# EasyEDA Pro project FPGA_IO_BOARD.eprj

# Schematic Schematic1
Create Date: 2023-08-28; Page Name: P1; Project Name: FPGA_IO_BOARD; Schematic Name: Schematic1; Update Date: 2023-09-22; Company: 嘉立创EDA; Page Size: A4; Version: V1.0
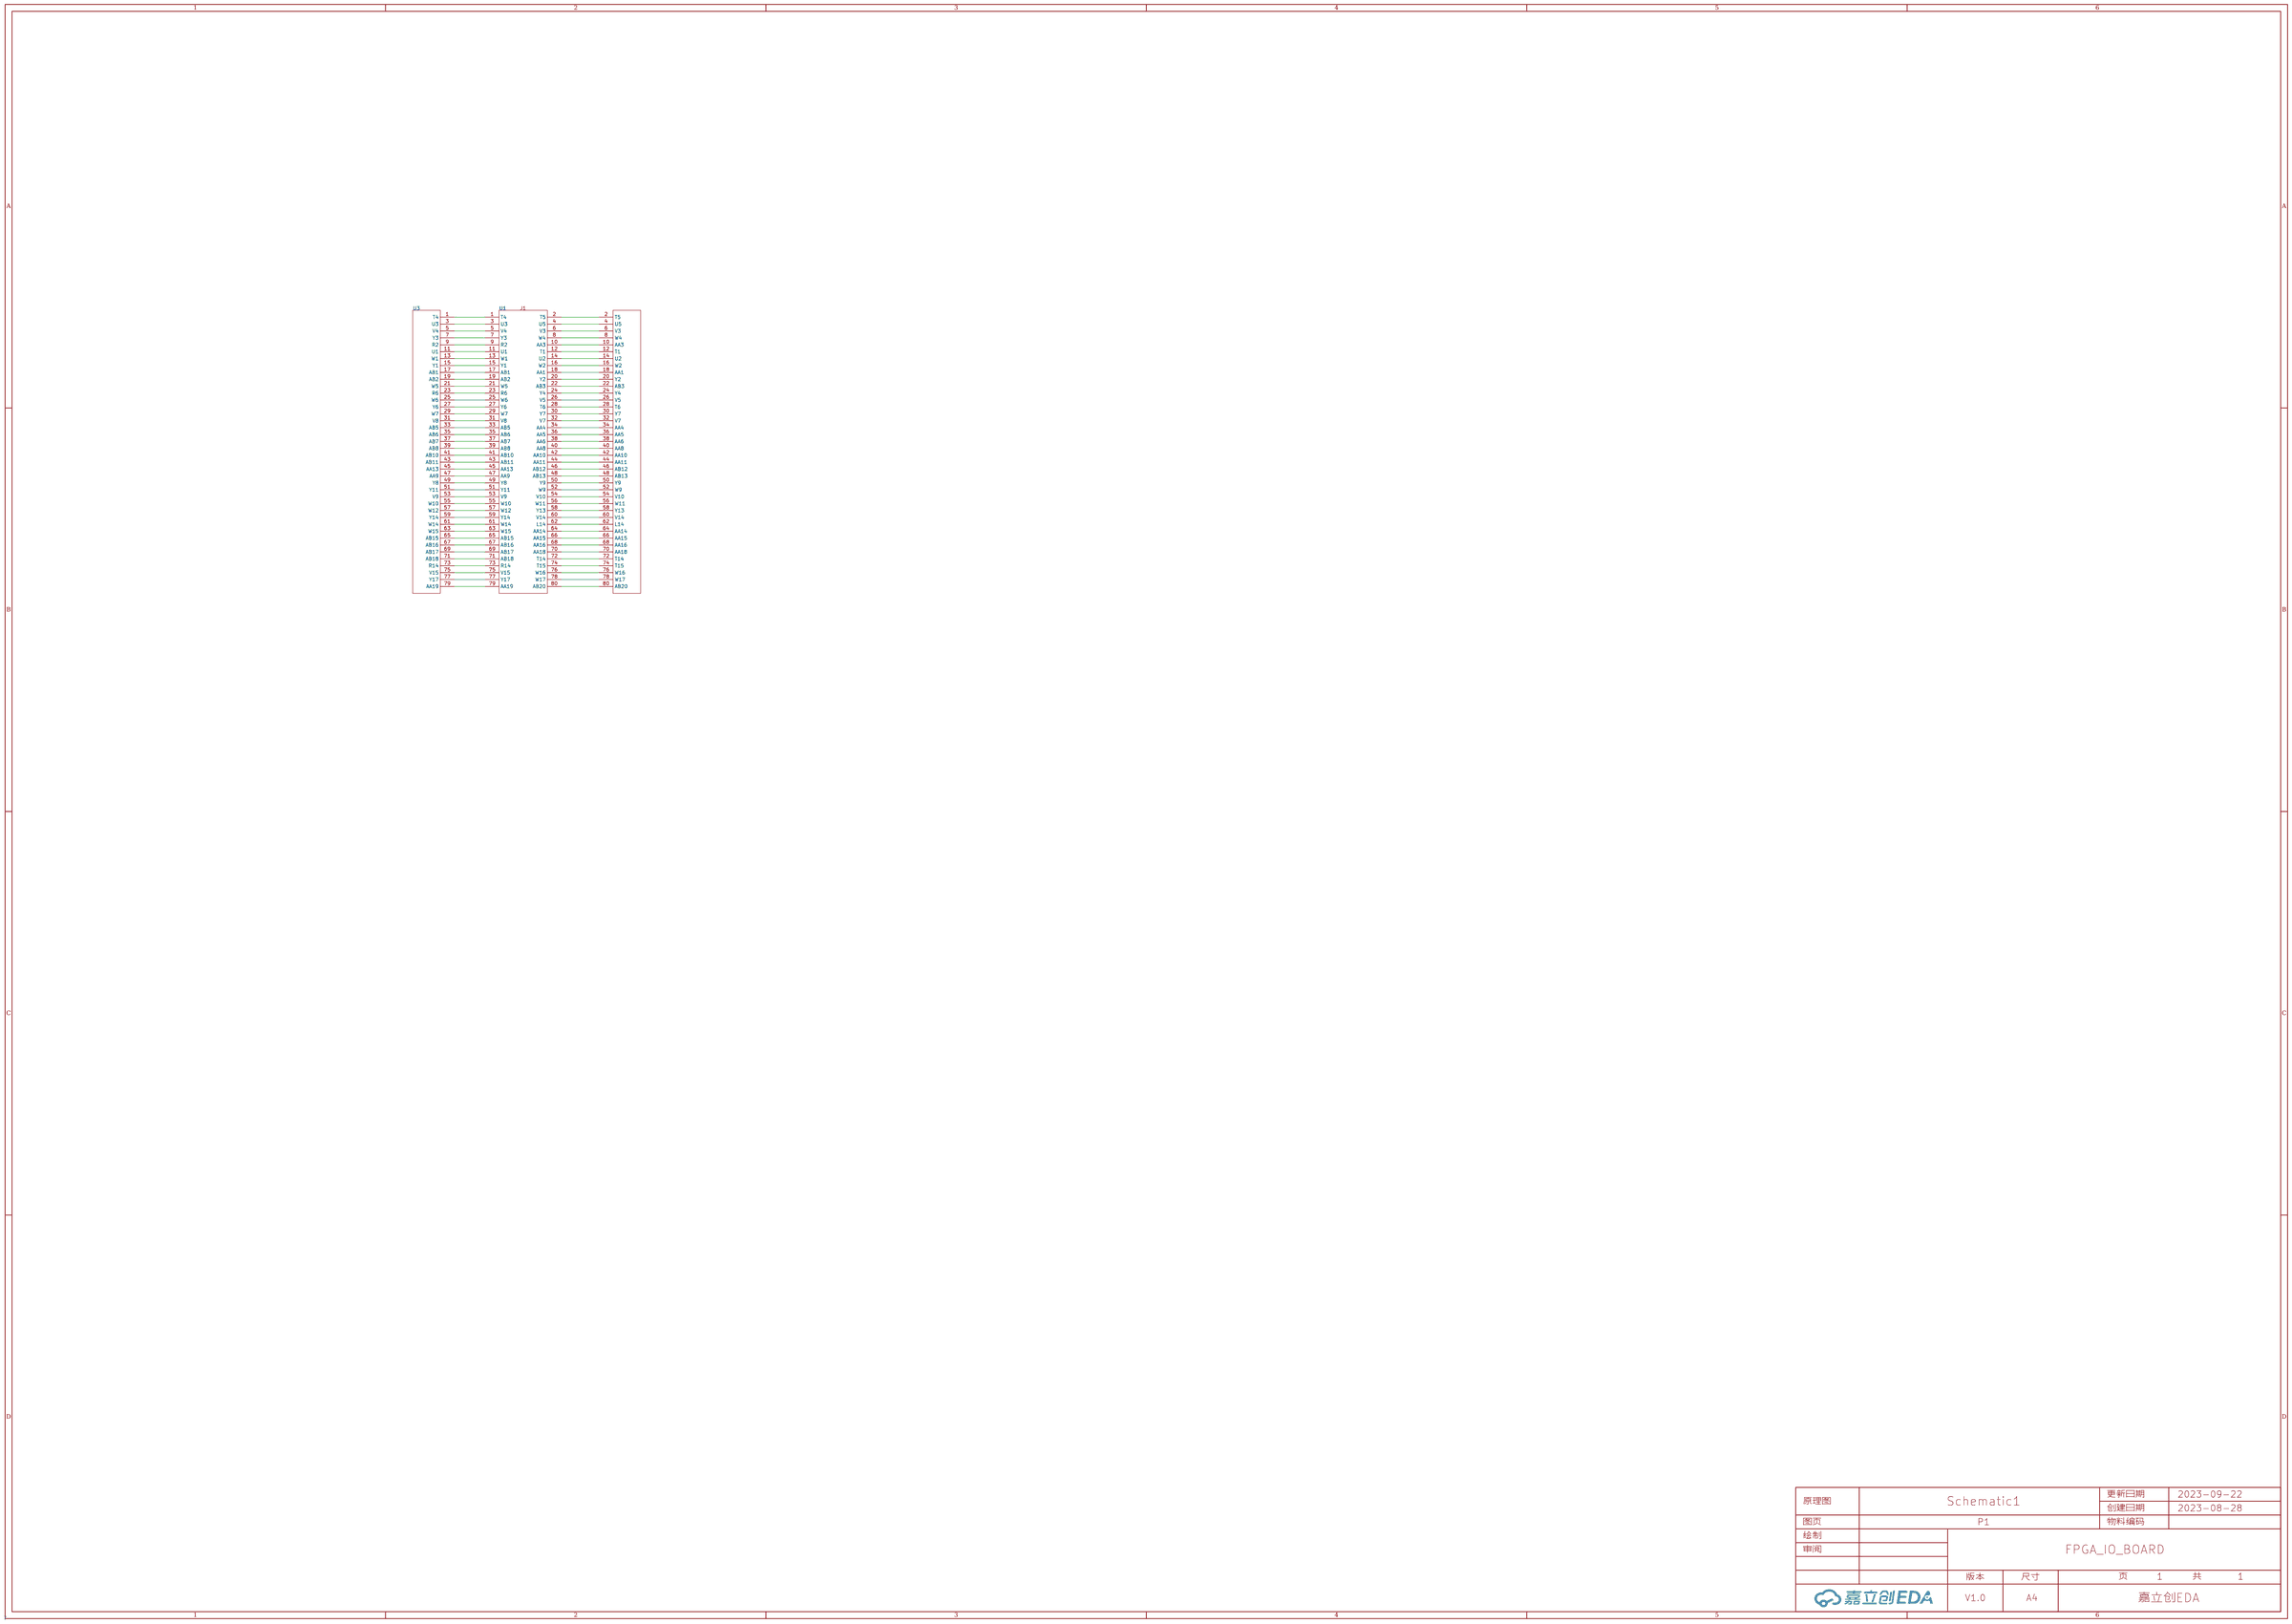
[diagram p0: schematic sheet]

## Parts
U1  -  [XC7A35T_127_PIN1_PIN80]
U3  -  [XC7A35T_254_PIN1_PIN80]

## Library data of the parts
U1 = XC7A35T_127_PIN1_PIN80: XC7A35T FPGA核心板第1脚到第80脚1.27mm底板
U3 = XC7A35T_254_PIN1_PIN80: FPGA核心板的2.54mm排针接口

## Nets
$1N7415: U1.80(AB20) U3.80(AB20)
$1N7417: U1.78(W17) U3.78(W17)
$1N7419: U1.76(W16) U3.76(W16)
$1N7421: U1.74(T15) U3.74(T15)
$1N7423: U1.72(T14) U3.72(T14)
$1N7425: U1.70(AA18) U3.70(AA18)
$1N7427: U1.68(AA16) U3.68(AA16)
$1N7429: U1.66(AA15) U3.66(AA15)
$1N7431: U1.64(AA14) U3.64(AA14)
$1N7433: U1.62(L14) U3.62(L14)
$1N7435: U1.60(V14) U3.60(V14)
$1N7437: U1.58(Y13) U3.58(Y13)
$1N7439: U1.56(W11) U3.56(W11)
$1N7441: U1.54(V10) U3.54(V10)
$1N7443: U1.52(W9) U3.52(W9)
$1N7445: U1.50(Y9) U3.50(Y9)
$1N7447: U1.48(AB13) U3.48(AB13)
$1N7449: U1.46(AB12) U3.46(AB12)
$1N7451: U1.44(AA11) U3.44(AA11)
$1N7453: U1.42(AA10) U3.42(AA10)
$1N7455: U1.40(AA8) U3.40(AA8)
$1N7457: U1.38(AA6) U3.38(AA6)
$1N7459: U1.36(AA5) U3.36(AA5)
$1N7461: U1.34(AA4) U3.34(AA4)
$1N7463: U1.32(V7) U3.32(V7)
$1N7465: U1.30(Y7) U3.30(Y7)
$1N7467: U1.28(T6) U3.28(T6)
$1N7469: U1.26(V5) U3.26(V5)
$1N7471: U1.24(Y4) U3.24(Y4)
$1N7473: U1.22(AB3) U3.22(AB3)
$1N7475: U1.20(Y2) U3.20(Y2)
$1N7477: U1.18(AA1) U3.18(AA1)
$1N7479: U1.16(W2) U3.16(W2)
$1N7481: U1.14(U2) U3.14(U2)
$1N7483: U1.12(T1) U3.12(T1)
$1N7485: U1.10(AA3) U3.10(AA3)
$1N7487: U1.8(W4) U3.8(W4)
$1N7489: U1.6(V3) U3.6(V3)
$1N7491: U1.4(U5) U3.4(U5)
$1N7493: U1.2(T5) U3.2(T5)
$1N7751: U1.1(T4) U3.1(T4)
$1N7753: U1.3(U3) U3.3(U3)
$1N7755: U1.5(V4) U3.5(V4)
$1N7757: U1.7(Y3) U3.7(Y3)
$1N7759: U1.9(R2) U3.9(R2)
$1N7761: U1.11(U1) U3.11(U1)
$1N7763: U1.13(W1) U3.13(W1)
$1N7765: U1.15(Y1) U3.15(Y1)
$1N7767: U1.17(AB1) U3.17(AB1)
$1N7769: U1.19(AB2) U3.19(AB2)
$1N7771: U1.21(W5) U3.21(W5)
$1N7773: U1.23(R6) U3.23(R6)
$1N7775: U1.25(W6) U3.25(W6)
$1N7777: U1.27(Y6) U3.27(Y6)
$1N7779: U1.29(W7) U3.29(W7)
$1N7781: U1.31(V8) U3.31(V8)
$1N7783: U1.33(AB5) U3.33(AB5)
$1N7785: U1.35(AB6) U3.35(AB6)
$1N7787: U1.37(AB7) U3.37(AB7)
$1N7789: U1.39(AB8) U3.39(AB8)
$1N7791: U1.41(AB10) U3.41(AB10)
$1N7793: U1.43(AB11) U3.43(AB11)
$1N7795: U1.45(AA13) U3.45(AA13)
$1N7797: U1.47(AA9) U3.47(AA9)
$1N7799: U1.49(Y8) U3.49(Y8)
$1N7801: U1.51(Y11) U3.51(Y11)
$1N7803: U1.53(V9) U3.53(V9)
$1N7805: U1.55(W10) U3.55(W10)
$1N7807: U1.57(W12) U3.57(W12)
$1N7809: U1.59(Y14) U3.59(Y14)
$1N7811: U1.61(W14) U3.61(W14)
$1N7813: U1.63(W15) U3.63(W15)
$1N7815: U1.65(AB15) U3.65(AB15)
$1N7817: U1.67(AB16) U3.67(AB16)
$1N7819: U1.69(AB17) U3.69(AB17)
$1N7821: U1.71(AB18) U3.71(AB18)
$1N7823: U1.73(R14) U3.73(R14)
$1N7825: U1.75(V15) U3.75(V15)
$1N7827: U1.77(Y17) U3.77(Y17)
$1N7829: U1.79(AA19) U3.79(AA19)

# Schematic Schematic2
Create Date: 2023-09-23; Page Name: P1; Project Name: FPGA_IO_BOARD; Schematic Name: Schematic2; Update Date: 2023-09-23; Company: 嘉立创EDA; Page Size: A4; Version: V1.0
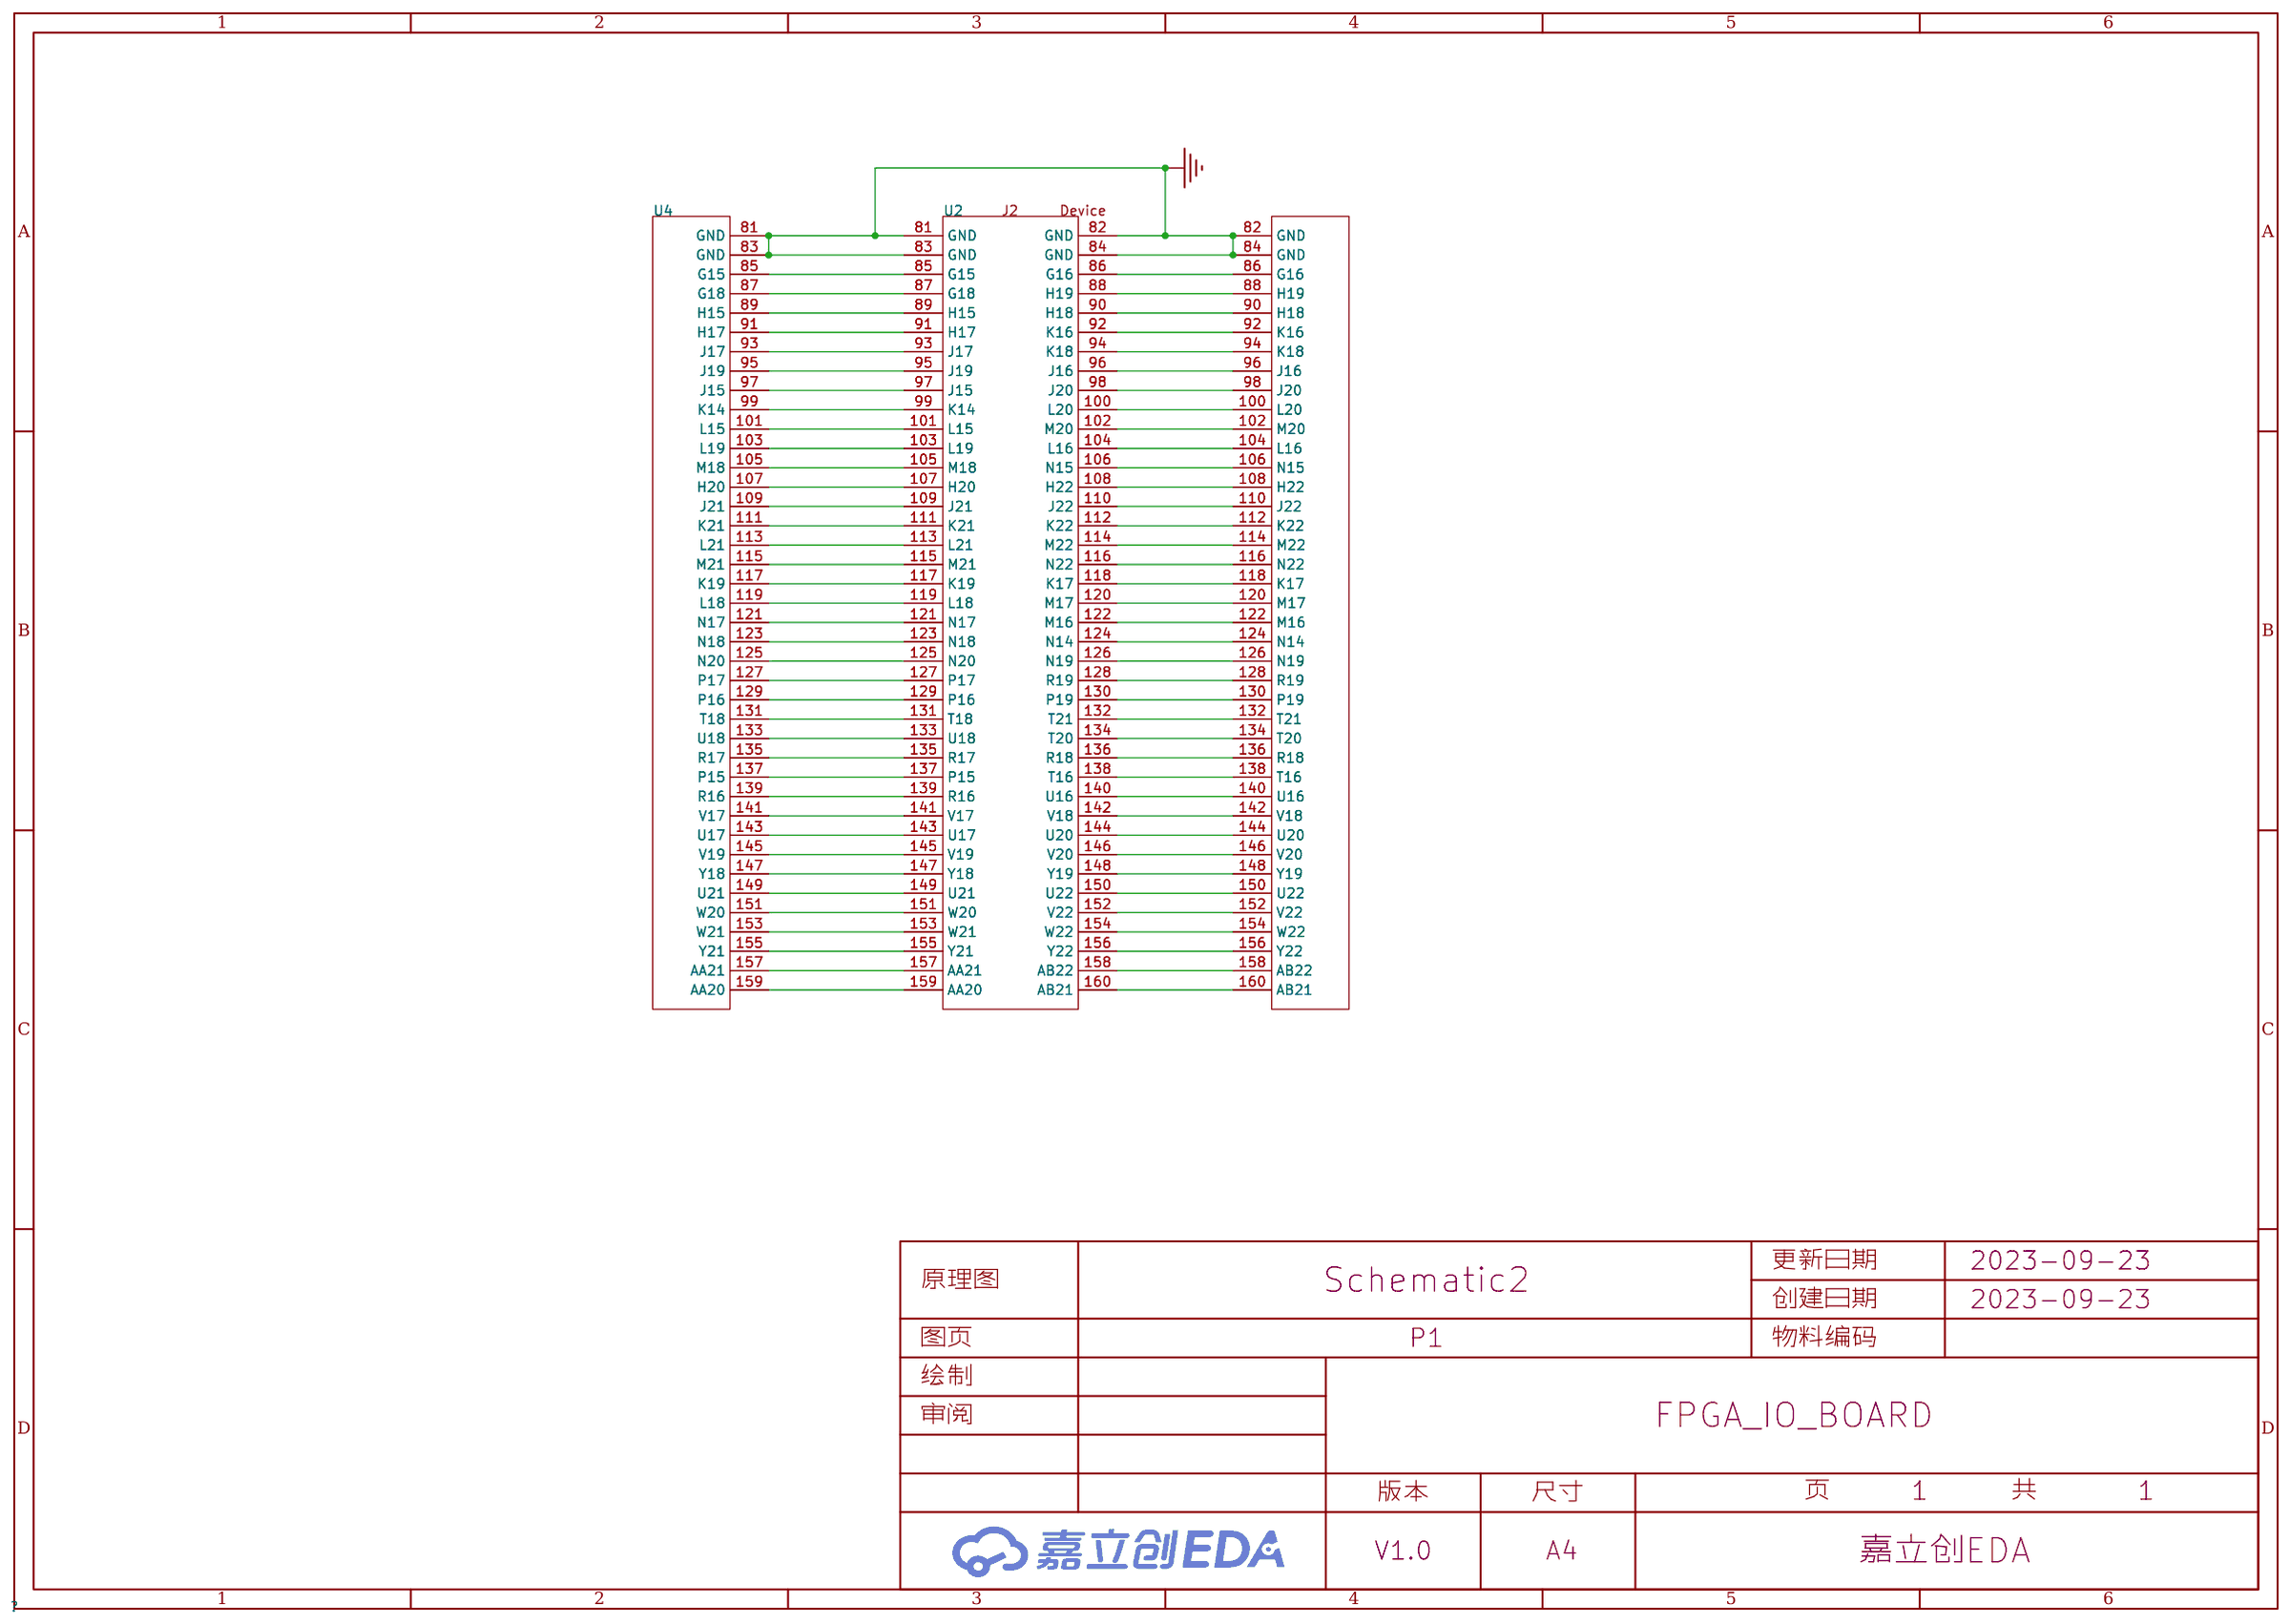
[diagram p1: schematic sheet]

## Parts
U2  -  [XC7A35T_127_PIN81_PIN160]
U4  -  [XC7A35T_254_PIN81_PIN160]

## Library data of the parts
U2 = XC7A35T_127_PIN81_PIN160: XC7A35T FPGA核心板1.27mm间距从81脚到160脚的底板扩展
U4 = XC7A35T_254_PIN81_PIN160: FPGA核心板的第81脚到第160脚扩展接口

## Nets
GND: U2.81(GND) U2.82(GND) U2.83(GND) U2.84(GND) U4.81(GND) U4.82(GND) U4.83(GND) U4.84(GND)
$1N559: U2.159(AA20) U4.159(AA20)
$1N560: U2.157(AA21) U4.157(AA21)
$1N561: U2.155(Y21) U4.155(Y21)
$1N562: U2.153(W21) U4.153(W21)
$1N563: U2.151(W20) U4.151(W20)
$1N564: U2.149(U21) U4.149(U21)
$1N565: U2.147(Y18) U4.147(Y18)
$1N566: U2.145(V19) U4.145(V19)
$1N567: U2.143(U17) U4.143(U17)
$1N568: U2.141(V17) U4.141(V17)
$1N569: U2.139(R16) U4.139(R16)
$1N570: U2.137(P15) U4.137(P15)
$1N571: U2.135(R17) U4.135(R17)
$1N572: U2.133(U18) U4.133(U18)
$1N573: U2.131(T18) U4.131(T18)
$1N574: U2.129(P16) U4.129(P16)
$1N575: U2.127(P17) U4.127(P17)
$1N576: U2.125(N20) U4.125(N20)
$1N577: U2.123(N18) U4.123(N18)
$1N578: U2.121(N17) U4.121(N17)
$1N579: U2.119(L18) U4.119(L18)
$1N580: U2.117(K19) U4.117(K19)
$1N581: U2.115(M21) U4.115(M21)
$1N582: U2.113(L21) U4.113(L21)
$1N583: U2.111(K21) U4.111(K21)
$1N584: U2.109(J21) U4.109(J21)
$1N585: U2.107(H20) U4.107(H20)
$1N586: U2.105(M18) U4.105(M18)
$1N587: U2.103(L19) U4.103(L19)
$1N588: U2.101(L15) U4.101(L15)
$1N589: U2.99(K14) U4.99(K14)
$1N590: U2.97(J15) U4.97(J15)
$1N591: U2.95(J19) U4.95(J19)
$1N592: U2.93(J17) U4.93(J17)
$1N593: U2.91(H17) U4.91(H17)
$1N594: U2.89(H15) U4.89(H15)
$1N595: U2.87(G18) U4.87(G18)
$1N596: U2.85(G15) U4.85(G15)
$1N597: U2.86(G16) U4.86(G16)
$1N598: U2.88(H19) U4.88(H19)
$1N599: U2.90(H18) U4.90(H18)
$1N600: U2.92(K16) U4.92(K16)
$1N601: U2.94(K18) U4.94(K18)
$1N602: U2.96(J16) U4.96(J16)
$1N603: U2.98(J20) U4.98(J20)
$1N604: U2.100(L20) U4.100(L20)
$1N605: U2.102(M20) U4.102(M20)
$1N606: U2.104(L16) U4.104(L16)
$1N607: U2.106(N15) U4.106(N15)
$1N608: U2.108(H22) U4.108(H22)
$1N609: U2.110(J22) U4.110(J22)
$1N610: U2.112(K22) U4.112(K22)
$1N611: U2.114(M22) U4.114(M22)
$1N612: U2.116(N22) U4.116(N22)
$1N613: U2.118(K17) U4.118(K17)
$1N614: U2.120(M17) U4.120(M17)
$1N615: U2.122(M16) U4.122(M16)
$1N616: U2.124(N14) U4.124(N14)
$1N617: U2.126(N19) U4.126(N19)
$1N618: U2.128(R19) U4.128(R19)
$1N619: U2.130(P19) U4.130(P19)
$1N620: U2.132(T21) U4.132(T21)
$1N621: U2.134(T20) U4.134(T20)
$1N622: U2.136(R18) U4.136(R18)
$1N623: U2.138(T16) U4.138(T16)
$1N624: U2.140(U16) U4.140(U16)
$1N625: U2.142(V18) U4.142(V18)
$1N626: U2.144(U20) U4.144(U20)
$1N627: U2.146(V20) U4.146(V20)
$1N628: U2.148(Y19) U4.148(Y19)
$1N629: U2.150(U22) U4.150(U22)
$1N630: U2.152(V22) U4.152(V22)
$1N631: U2.154(W22) U4.154(W22)
$1N632: U2.156(Y22) U4.156(Y22)
$1N633: U2.158(AB22) U4.158(AB22)
$1N634: U2.160(AB21) U4.160(AB21)

# Board PCB1
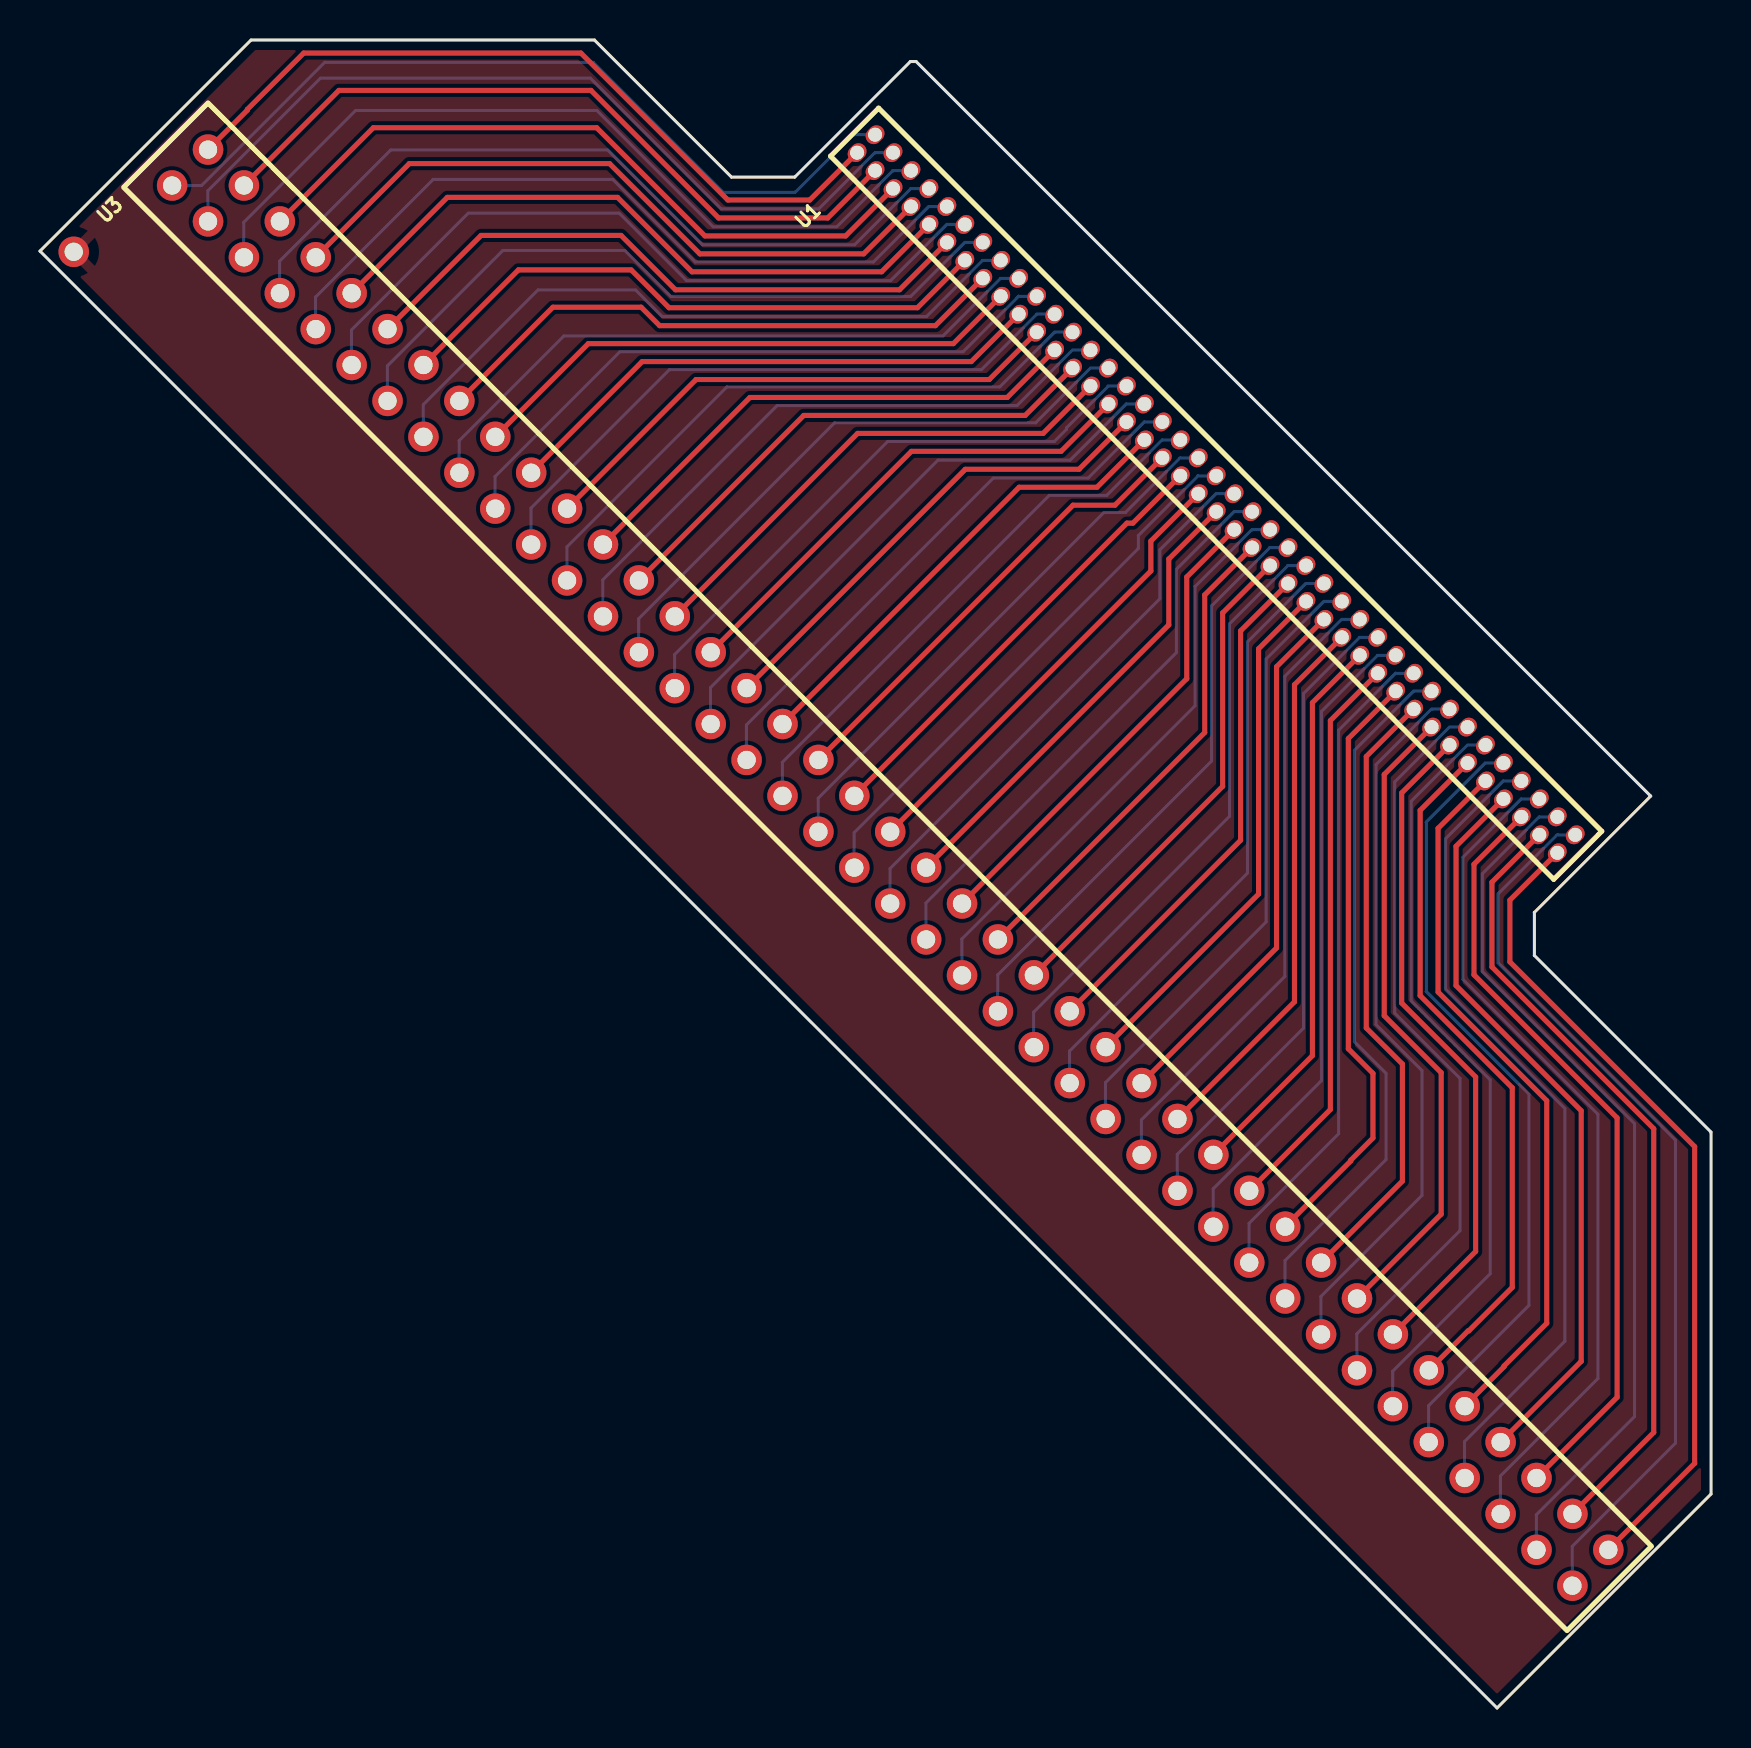
[diagram p2: board, top side]
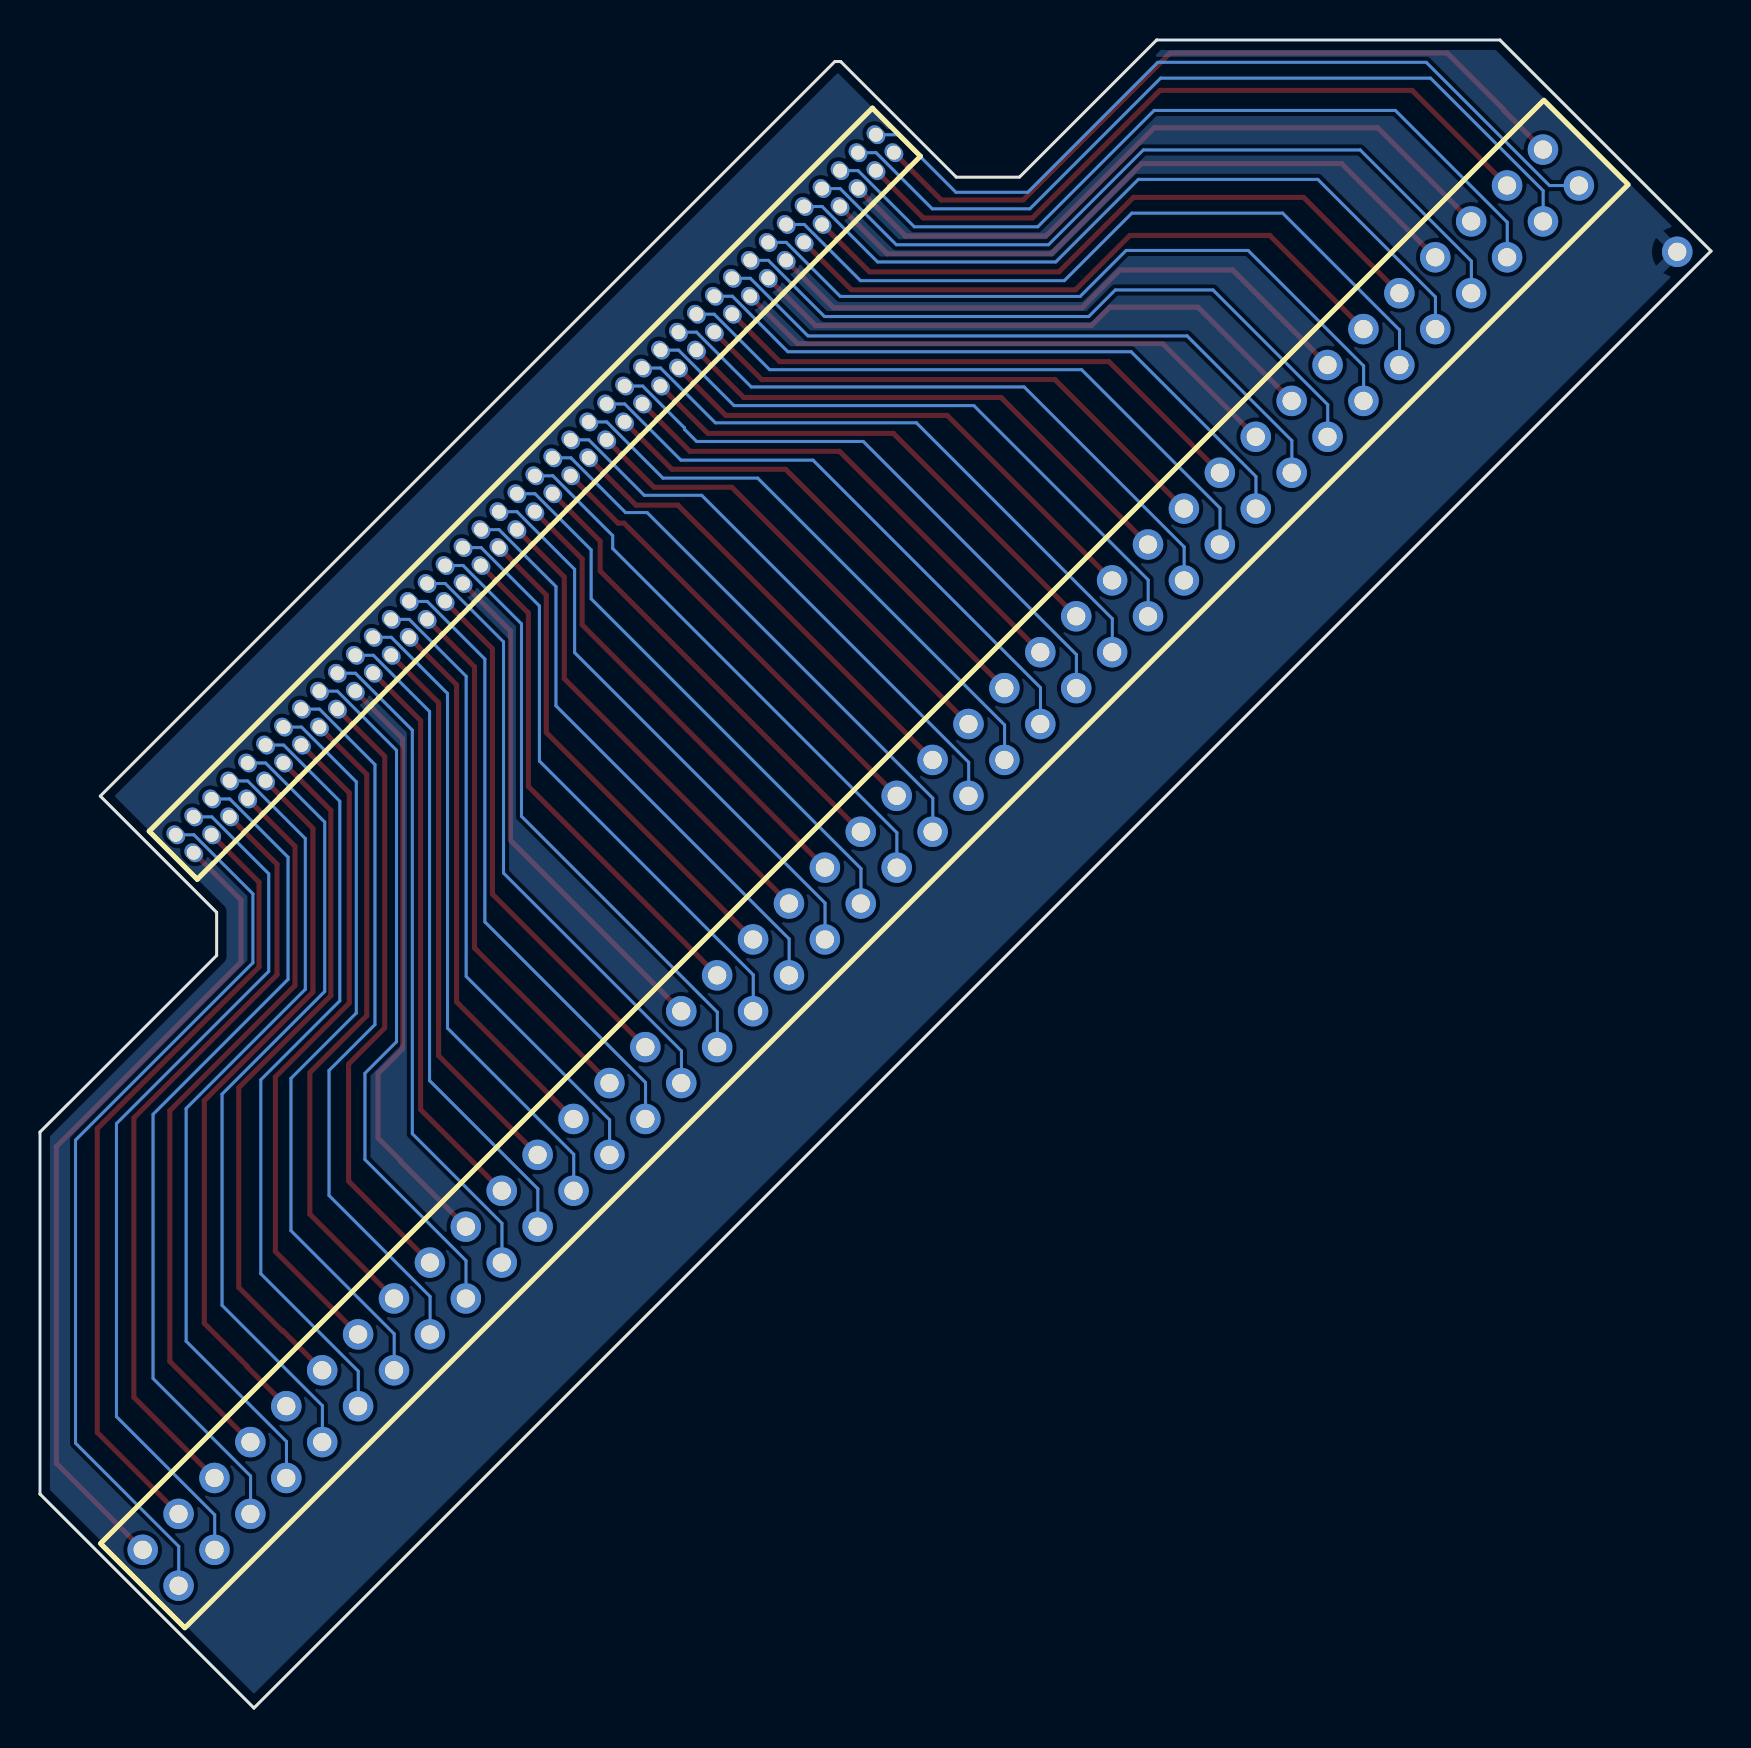
[diagram p3: board, bottom side, seen from below]

Outline 83.59 x 83.44 mm; copper layers: Top Layer, Bottom Layer. Coordinates in mm from the lower left corner of the outline.
Outline path: 0,72.88 72.88,0 83.59,10.7 83.59,28.81 74.75,37.65 74.75,39.8 80.57,45.62 43.82,82.37 43.54,82.37 37.75,76.58 34.59,76.58 27.73,83.44 10.56,83.44 0,72.88
Stack: Top Layer 0.035mm / Dielectric1 1.51mm FR4 er 4.5 / Bottom Layer 0.035mm

## Design rules (mm)
template: JLCPCB Capability(Two Layers Board)
spacing copperThickness1oz (default): track to track 0.102, other pairs 0.152 to 0.3
spacing copperThickness2oz: track to track 0.203, other pairs 0.152 to 0.3
track width copperThickness1oz (default): min 0.127, default 0.254, max 2.54
track width copperThickness2oz: min 0.203, default 0.254, max 2.54
differential pair differentialPair (default): width min 0.127, default 0.254, max 2.54; gap min 0.152, default 0.152
via viaSize (default): diameter min 0.5, default 0.61, max 10; hole min 0.3, default 0.305, max 6.3

## Placement (name value [footprint] x y rotation side)
NOREF  -  [Pad_e1113]  1.69 72.85 45 top
U1  -  [XC7A35T_127_PIN1_PIN80]  59.91 59.67 45 top
U3  -  [XC7A35T_254_PIN1_PIN80]  42.44 42.13 45 top

## Footprints (pads in the part's own frame, mm; a bottom-side part is the same pattern mirrored in y, then rotated)
Pad_e1113
  round 1.524 hole 0.914: 1(0,0)
XC7A35T_127_PIN1_PIN80
  oval 0.998x0.8 hole 0.63x0.7: 1(-0.635,26.289) 2(0.635,26.289) 3(-0.635,25.019) 4(0.635,25.019) 5(-0.635,23.749) 6(0.635,23.749) 7(-0.635,22.479) 8(0.635,22.479) 9(-0.635,21.209) 10(0.635,21.209) 11(-0.635,19.939) 12(0.635,19.939) 13(-0.635,18.669) 14(0.635,18.669) 15(-0.635,17.399) 16(0.635,17.399) 17(-0.635,16.129) 18(0.635,16.129) 19(-0.635,14.859) 20(0.635,14.859) 21(-0.635,13.589) 22(0.635,13.589) 23(-0.635,12.319) 24(0.635,12.319) 25(-0.635,11.049) 26(0.635,11.049) 27(-0.635,9.779) 28(0.635,9.779) 29(-0.635,8.509) 30(0.635,8.509) 31(-0.635,7.239) 32(0.635,7.239) 33(-0.635,5.969) 34(0.635,5.969) 35(-0.635,4.699) 36(0.635,4.699) 37(-0.635,3.429) 38(0.635,3.429) 39(-0.635,2.159) 40(0.635,2.159) 41(-0.635,0.889) 42(0.635,0.889) 43(-0.635,-0.381) 44(0.635,-0.381) 45(-0.635,-1.651) 46(0.635,-1.651) 47(-0.635,-2.921) 48(0.635,-2.921) 49(-0.635,-4.191) 50(0.635,-4.191) 51(-0.635,-5.461) 52(0.635,-5.461) 53(-0.635,-6.731) 54(0.635,-6.731) 55(-0.635,-8.001) 56(0.635,-8.001) 57(-0.635,-9.271) 58(0.635,-9.271) 59(-0.635,-10.541) 60(0.635,-10.541) 61(-0.635,-11.811) 62(0.635,-11.811) 63(-0.635,-13.081) 64(0.635,-13.081) 65(-0.635,-14.351) 66(0.635,-14.351) 67(-0.635,-15.621) 68(0.635,-15.621) 69(-0.635,-16.891) 70(0.635,-16.891) 71(-0.635,-18.161) 72(0.635,-18.161) 73(-0.635,-19.431) 74(0.635,-19.431) 75(-0.635,-20.701) 76(0.635,-20.701) 77(-0.635,-21.971) 78(0.635,-21.971) 79(-0.635,-23.241) 80(0.635,-23.241)
XC7A35T_254_PIN1_PIN80
  round 1.524 hole 0.914: 1(1.27,49.403) 2(-1.27,49.403) 3(1.27,46.863) 4(-1.27,46.863) 5(1.27,44.323) 6(-1.27,44.323) 7(1.27,41.783) 8(-1.27,41.783) 9(1.27,39.243) 10(-1.27,39.243) 11(1.27,36.703) 12(-1.27,36.703) 13(1.27,34.163) 14(-1.27,34.163) 15(1.27,31.623) 16(-1.27,31.623) 17(1.27,29.083) 18(-1.27,29.083) 19(1.27,26.543) 20(-1.27,26.543) 21(1.27,24.003) 22(-1.27,24.003) 23(1.27,21.463) 24(-1.27,21.463) 25(1.27,18.923) 26(-1.27,18.923) 27(1.27,16.383) 28(-1.27,16.383) 29(1.27,13.843) 30(-1.27,13.843) 31(1.27,11.303) 32(-1.27,11.303) 33(1.27,8.763) 34(-1.27,8.763) 35(1.27,6.223) 36(-1.27,6.223) 37(1.27,3.683) 38(-1.27,3.683) 39(1.27,1.143) 40(-1.27,1.143) 41(1.27,-1.397) 42(-1.27,-1.397) 43(1.27,-3.937) 44(-1.27,-3.937) 45(1.27,-6.477) 46(-1.27,-6.477) 47(1.27,-9.017) 48(-1.27,-9.017) 49(1.27,-11.557) 50(-1.27,-11.557) 51(1.27,-14.097) 52(-1.27,-14.097) 53(1.27,-16.637) 54(-1.27,-16.637) 55(1.27,-19.177) 56(-1.27,-19.177) 57(1.27,-21.717) 58(-1.27,-21.717) 59(1.27,-24.257) 60(-1.27,-24.257) 61(1.27,-26.797) 62(-1.27,-26.797) 63(1.27,-29.337) 64(-1.27,-29.337) 65(1.27,-31.877) 66(-1.27,-31.877) 67(1.27,-34.417) 68(-1.27,-34.417) 69(1.27,-36.957) 70(-1.27,-36.957) 71(1.27,-39.497) 72(-1.27,-39.497) 73(1.27,-42.037) 74(-1.27,-42.037) 75(1.27,-44.577) 76(-1.27,-44.577) 77(1.27,-47.117) 78(-1.27,-47.117) 79(1.27,-49.657) 80(-1.27,-49.657)

## Nets
As in the schematic.

## Routing (per net, layer and track width the routed paths; a pad name or vN(x,y) marks a point on that pad's centre or on a via; arc(x,y) is an arc through that point)
$1N7415: length 45.5
  Bottom Layer w0.152: U1.80 75.89,43.68 72.94,40.73 72.94,37.28 81.81,28.41 81.81,13.25 76.65,8.09 76.65,6.12
$1N7417: length 43.9
  Bottom Layer w0.152: 74.85,7.91 74.85,9.67 79.76,14.58 79.76,29.23 72.15,36.85 72.15,41.73 74.99,44.58 U1.78
$1N7419: length 42.7
  Bottom Layer w0.152: U1.76 74.1,45.48 71.18,42.56 71.18,36.45 77.93,29.7 77.93,16.48 73.05,11.61 73.05,9.71
$1N7421: length 41.5
  Bottom Layer w0.152: 71.26,11.51 71.26,13.33 76.28,18.35 76.28,29.99 70.32,35.95 70.32,43.5 73.2,46.38 U1.74
$1N7423: length 40.3
  Bottom Layer w0.152: U1.72 72.3,47.28 69.35,44.32 69.35,35.84 74.48,30.71 74.48,20.15 69.46,15.13 69.46,13.3
$1N7425: length 38.8
  Bottom Layer w0.152: U1.70 71.4,48.17 68.59,45.36 68.59,35.38 72.54,31.43 72.54,21.73 67.67,16.85 67.67,15.1
$1N7427: length 37.7
  Bottom Layer w0.152: U1.68 70.5,49.07 67.77,46.33 67.77,34.77 71.03,31.5 71.03,23.88 65.87,18.72 65.87,16.89
$1N7429: length 36.4
  Bottom Layer w0.152: U1.66 69.61,49.97 66.83,47.19 66.83,34.19 69.13,31.89 69.13,25.64 64.07,20.59 64.07,18.69
$1N7431: length 35.3
  Bottom Layer w0.152: U1.64 68.71,50.87 65.75,47.91 65.75,33.33 67.33,31.75 67.33,27.44 62.28,22.38 62.28,20.49
$1N7433: length 33.4
  Bottom Layer w0.152: U1.62 67.81,51.77 64.96,48.92 64.96,28.73 60.48,24.25 60.48,22.28
$1N7435: length 32.9
  Bottom Layer w0.152: U1.60 66.91,52.66 64.1,49.85 64.1,31.39 58.69,25.97 58.69,24.08
$1N7437: length 32.4
  Bottom Layer w0.152: U1.58 66.01,53.56 63.2,50.75 63.2,34.01 56.89,27.7 56.89,25.87
$1N7439: length 31.8
  Bottom Layer w0.152: U1.56 65.12,54.46 62.27,51.61 62.27,36.6 55.09,29.42 55.09,27.67
$1N7441: length 31.3
  Bottom Layer w0.152: U1.54 64.22,55.36 61.34,52.48 61.34,39.33 53.3,31.29 53.3,29.47
$1N7443: length 30.8
  Bottom Layer w0.152: 51.5,31.26 51.5,32.87 60.4,41.77 60.4,53.34 63.32,56.26 U1.52
$1N7445: length 30.3
  Bottom Layer w0.152: U1.50 62.42,57.15 59.5,54.23 59.5,44.61 49.71,34.81 49.71,33.06
$1N7447: length 29.7
  Bottom Layer w0.152: 47.91,34.85 47.91,36.68 58.61,47.37 58.61,55.13 61.52,58.05 U1.48
$1N7449: length 29.2
  Bottom Layer w0.152: U1.46 60.63,58.95 57.78,56.1 57.78,50.14 46.11,38.47 46.11,36.65
$1N7451: length 28.7
  Bottom Layer w0.152: 44.32,38.45 44.32,40.27 56.85,52.8 56.85,56.97 59.73,59.85 U1.44
$1N7453: length 28.2
  Bottom Layer w0.152: U1.42 58.83,60.75 56.02,57.94 56.02,55.49 42.52,41.99 42.52,40.24
$1N7455: length 27.6
  Bottom Layer w0.152: 58.83,61.64 57.93,61.64 54.94,58.65 54.94,58.01 40.72,43.79 40.72,42.04
$1N7457: length 27.7
  Bottom Layer w0.152: 38.93,43.83 38.93,45.52 53.22,59.8 54.3,59.8 57.03,62.54 U1.38
$1N7459: length 28.3
  Bottom Layer w0.152: 37.13,45.63 37.13,47.31 50.49,60.67 53.36,60.67 56.14,63.44 57.04,63.44
$1N7461: length 28.8
  Bottom Layer w0.152: U1.34 55.24,64.34 52.43,61.53 47.69,61.53 35.34,49.18 35.34,47.43
$1N7463: length 29.4
  Bottom Layer w0.152: 55.24,65.24 54.34,65.24 51.53,62.43 44.92,62.43 33.54,51.05 33.54,49.22
$1N7465: length 29.9
  Bottom Layer w0.152: 31.75,51.02 31.75,52.7 42.41,63.36 50.74,63.36 51.35,63.97 51.35,64.04 53.44,66.13 U1.30
$1N7467: length 30.4
  Bottom Layer w0.152: 53.45,67.03 52.54,67.03 49.81,64.29 39.75,64.29 29.95,54.5 29.95,52.81
$1N7469: length 31
  Bottom Layer w0.152: 28.15,54.61 28.15,56.44 36.87,65.16 48.87,65.16 51.65,67.93 U1.26
$1N7471: length 31.4
  Bottom Layer w0.152: 26.36,56.41 26.36,58.09 34.36,66.09 48.01,66.09 50.75,68.83 51.65,68.83
$1N7473: length 32
  Bottom Layer w0.152: U1.22 49.86,69.73 47.09,66.95 31.49,66.95 24.56,60.03 24.56,58.2
$1N7475: length 32.4
  Bottom Layer w0.152: 22.76,60 22.76,61.61 29.01,67.85 46.18,67.85 48.95,70.62 49.85,70.62
$1N7477: length 33
  Bottom Layer w0.152: U1.18 48.05,71.52 45.17,68.64 26.2,68.64 20.97,63.4 20.97,61.8
$1N7479: length 34.6
  Bottom Layer w0.152: 19.17,63.59 19.17,65.2 24.91,70.94 29.8,70.94 31.13,69.61 44.34,69.61 47.16,72.42 48.06,72.42
$1N7481: length 36
  Bottom Layer w0.152: 17.38,65.39 17.38,67.14 23.15,72.91 29.26,72.91 31.56,70.62 43.55,70.62 46.26,73.32 U1.14
$1N7483: length 37.4
  Bottom Layer w0.152: 15.58,67.18 15.58,68.94 21.43,74.78 28.97,74.78 32.35,71.41 42.55,71.41 45.36,74.22 46.26,74.22
$1N7485: length 38.5
  Bottom Layer w0.152: 13.78,68.98 13.78,70.59 19.67,76.47 28.65,76.47 32.78,72.34 41.69,72.34 44.46,75.11 45.36,75.11
$1N7487: length 39.5
  Bottom Layer w0.152: 11.99,70.78 11.99,72.38 17.55,77.94 28.4,77.94 33.14,73.2 40.75,73.2 43.56,76.01 U1.8
$1N7489: length 41
  Bottom Layer w0.152: 43.57,76.91 42.67,76.91 39.85,74.1 33.68,74.1 27.86,79.92 15.79,79.92 10.19,74.32 10.19,72.57
$1N7491: length 42
  Bottom Layer w0.152: U1.4 41.77,77.81 38.96,75 34.07,75 27.53,81.54 14.03,81.54 8.4,75.9 8.4,74.37
$1N7493: length 41.6
  Bottom Layer w0.152: 6.6,76.16 8.08,76.16 14.24,82.33 27.68,82.33 34.18,75.82 37.77,75.82 40.65,78.71 U1.2
$1N7751: length 38.5
  Top Layer w0.254: U1.1 38.5,75.44 34.41,75.44 27.06,82.79 13.19,82.79 10.37,79.97 10.37,79.94 8.4,77.96
$1N7753: length 37.2
  Top Layer w0.254: 10.19,76.16 14.95,80.92 27.56,80.92 33.94,74.54 39.4,74.54 U1.3
$1N7755: length 35.8
  Top Layer w0.254: 11.99,74.37 16.68,79.06 27.85,79.06 33.26,73.64 40.3,73.64 U1.5
$1N7757: length 34.6
  Top Layer w0.254: 13.78,72.57 18.47,77.26 28.49,77.26 33.01,72.74 41.2,72.74 43.57,75.11
$1N7759: length 33.4
  Top Layer w0.254: U1.9 42.1,71.85 32.61,71.85 28.89,75.57 20.38,75.57 15.58,70.78
$1N7761: length 32
  Top Layer w0.254: 17.38,68.98 22.06,73.67 29.07,73.67 31.79,70.95 43,70.95 45.36,73.32
$1N7763: length 30.8
  Top Layer w0.254: 19.17,67.18 23.93,71.94 29.57,71.94 31.46,70.05 43.89,70.05 46.26,72.42
$1N7765: length 29.5
  Top Layer w0.254: U1.15 44.79,69.15 31,69.15 30.07,70.08 25.66,70.08 20.97,65.39
$1N7767: length 28.2
  Top Layer w0.254: 48.06,70.62 45.69,68.25 27.43,68.25 22.76,63.59
$1N7769: length 27.7
  Top Layer w0.254: 24.56,61.8 30.12,67.36 46.59,67.36 U1.19
$1N7771: length 27.2
  Top Layer w0.254: 26.36,60 32.82,66.46 47.49,66.46 49.85,68.83
$1N7773: length 26.6
  Top Layer w0.254: U1.23 48.38,65.56 35.51,65.56 28.15,58.2
$1N7775: length 26.1
  Top Layer w0.254: 29.95,56.41 38.2,64.66 49.28,64.66 51.65,67.03
$1N7777: length 25.6
  Top Layer w0.254: U1.27 50.18,63.76 40.9,63.76 31.75,54.61
$1N7779: length 25.1
  Top Layer w0.254: 33.54,52.81 43.59,62.87 51.08,62.87 53.45,65.24
$1N7781: length 24.5
  Top Layer w0.254: 35.34,51.02 46.29,61.97 51.98,61.97 U1.31
$1N7783: length 24
  Top Layer w0.254: 55.24,63.44 52.87,61.07 48.98,61.07 37.13,49.22
$1N7785: length 23.5
  Top Layer w0.254: 38.93,47.43 51.67,60.17 53.77,60.17 U1.35
$1N7787: length 22.9
  Top Layer w0.254: 40.72,45.63 54.37,59.27 54.67,59.27 57.04,61.64
$1N7789: length 23.3
  Top Layer w0.254: 42.52,43.83 55.57,56.88 55.57,58.38 U1.39
$1N7791: length 23.8
  Top Layer w0.254: 44.32,42.04 56.47,54.19 56.47,57.48 58.83,59.85
$1N7793: length 24.3
  Top Layer w0.254: 46.11,40.24 57.36,51.49 57.36,56.58 U1.43
$1N7795: length 24.9
  Top Layer w0.254: 47.91,38.45 58.26,48.8 58.26,55.68 U1.45
$1N7797: length 25.4
  Top Layer w0.254: 49.71,36.65 59.16,46.1 59.16,54.78 U1.47
$1N7799: length 25.9
  Top Layer w0.254: U1.49 60.06,53.89 60.06,43.41 51.5,34.85
$1N7801: length 26.5
  Top Layer w0.254: U1.51 60.96,52.99 60.96,40.72 53.3,33.06
$1N7803: length 27
  Top Layer w0.254: 55.09,31.26 61.85,38.02 61.85,52.09 U1.53
$1N7805: length 27.5
  Top Layer w0.254: U1.55 62.75,51.19 62.75,35.33 56.89,29.47
$1N7807: length 28
  Top Layer w0.254: U1.57 63.65,50.29 63.65,32.63 58.69,27.67
$1N7809: length 28.6
  Top Layer w0.254: 60.48,25.87 64.55,29.94 64.55,49.4 U1.59
$1N7811: length 30.1
  Top Layer w0.254: 62.28,24.08 65.56,27.37 65.56,27.4 66.68,28.51 66.68,31.75 65.45,32.98 65.45,48.5 U1.61
$1N7813: length 31.1
  Top Layer w0.254: 64.07,22.28 68.15,26.36 68.15,32.21 66.34,34.02 66.34,47.6 U1.63
$1N7815: length 32.5
  Top Layer w0.254: 65.87,20.49 70.09,24.71 70.09,31.78 67.24,34.63 67.24,46.7 U1.65
$1N7817: length 33.7
  Top Layer w0.254: 67.67,18.69 71.81,22.84 71.81,31.57 68.12,35.27 68.12,45.78 U1.67
$1N7819: length 35
  Top Layer w0.254: U1.69 69.04,44.91 69.04,35.64 73.65,31.03 73.65,21.04 71.47,18.87 71.44,18.87 69.46,16.89
$1N7821: length 36.2
  Top Layer w0.254: U1.71 69.94,44.01 69.94,35.82 75.37,30.38 75.37,19.25 73.23,17.11 73.23,17.07 71.26,15.1
$1N7823: length 37.4
  Top Layer w0.254: U1.73 70.83,43.11 70.83,36.14 77.1,29.88 77.1,17.34 73.05,13.3
$1N7825: length 38.7
  Top Layer w0.254: U1.75 71.73,42.21 71.73,36.68 78.89,29.52 78.89,15.55 74.85,11.51
$1N7827: length 40
  Top Layer w0.254: U1.77 72.63,41.31 72.63,37.07 80.72,28.98 80.72,13.79 76.65,9.71
$1N7829: length 41.5
  Top Layer w0.254: 78.44,7.91 82.77,12.24 82.77,28.08 73.53,37.33 73.53,40.42 U1.79

## Copper pours and planes (outline as drawn; the poured copper is in the pictures)
GND on Top Layer: 83.59,10.7 83.59,28.81 74.75,37.65 74.75,39.8 80.57,45.62 43.82,82.37 43.54,82.37 37.75,76.58 34.59,76.58 27.73,83.44 10.56,83.44 0,72.88 72.88,0
GND on Bottom Layer: 83.59,10.7 83.59,28.81 74.75,37.65 74.75,39.8 80.57,45.62 43.82,82.37 43.54,82.37 37.75,76.58 34.59,76.58 27.73,83.44 10.56,83.44 0,72.88 72.88,0

# Board PCB5
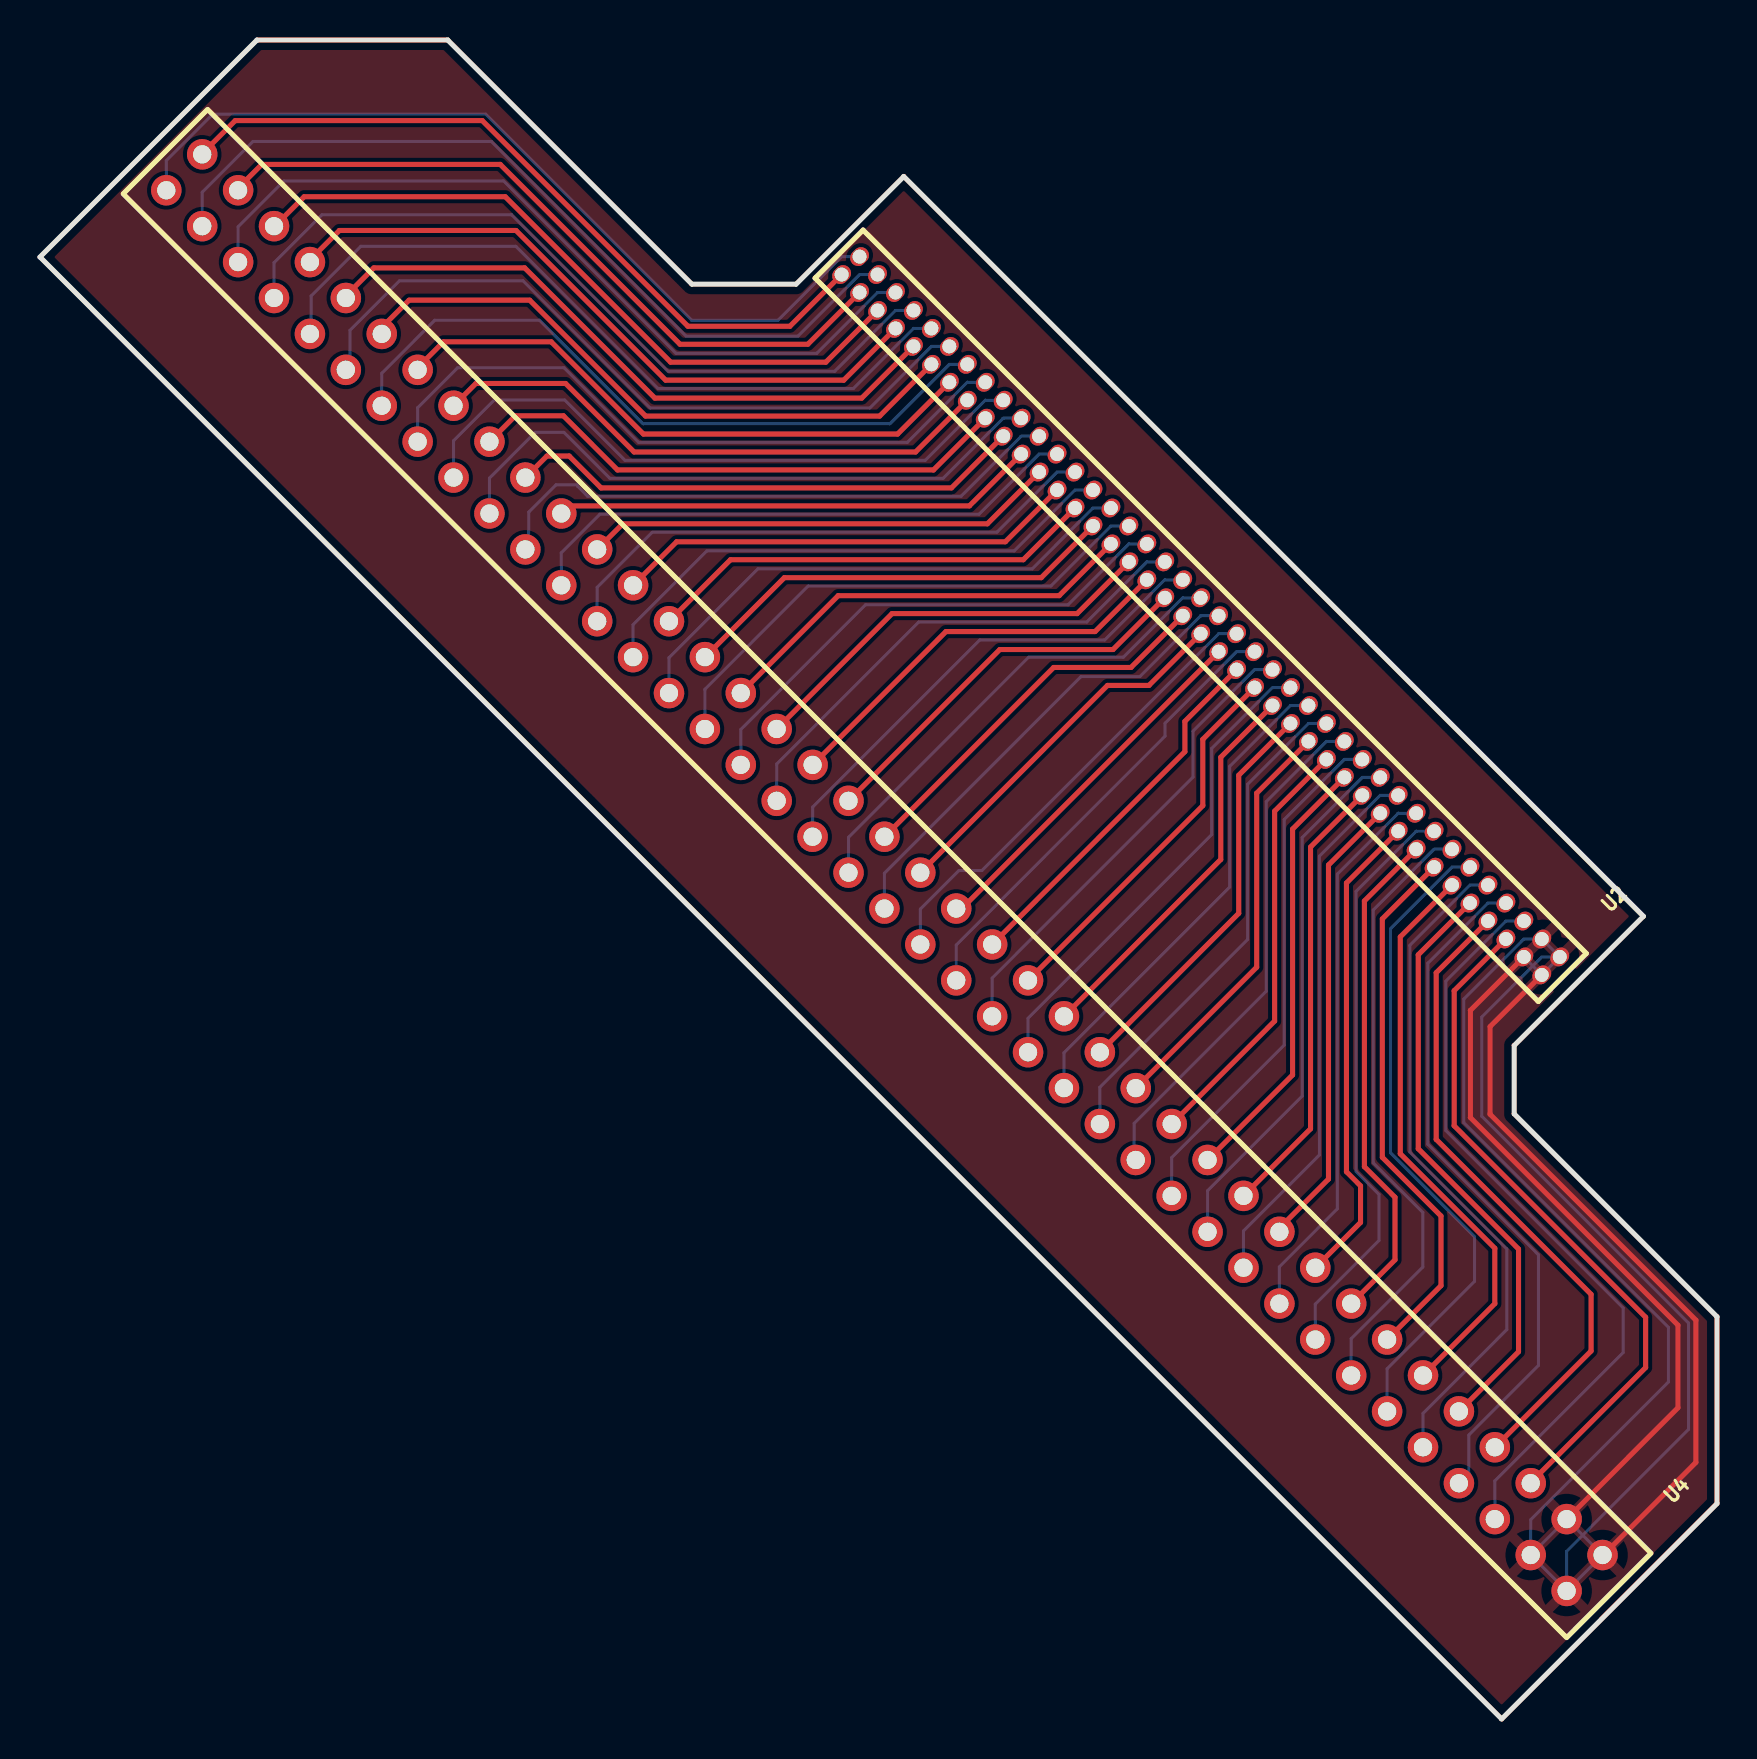
[diagram p4: board, top side]
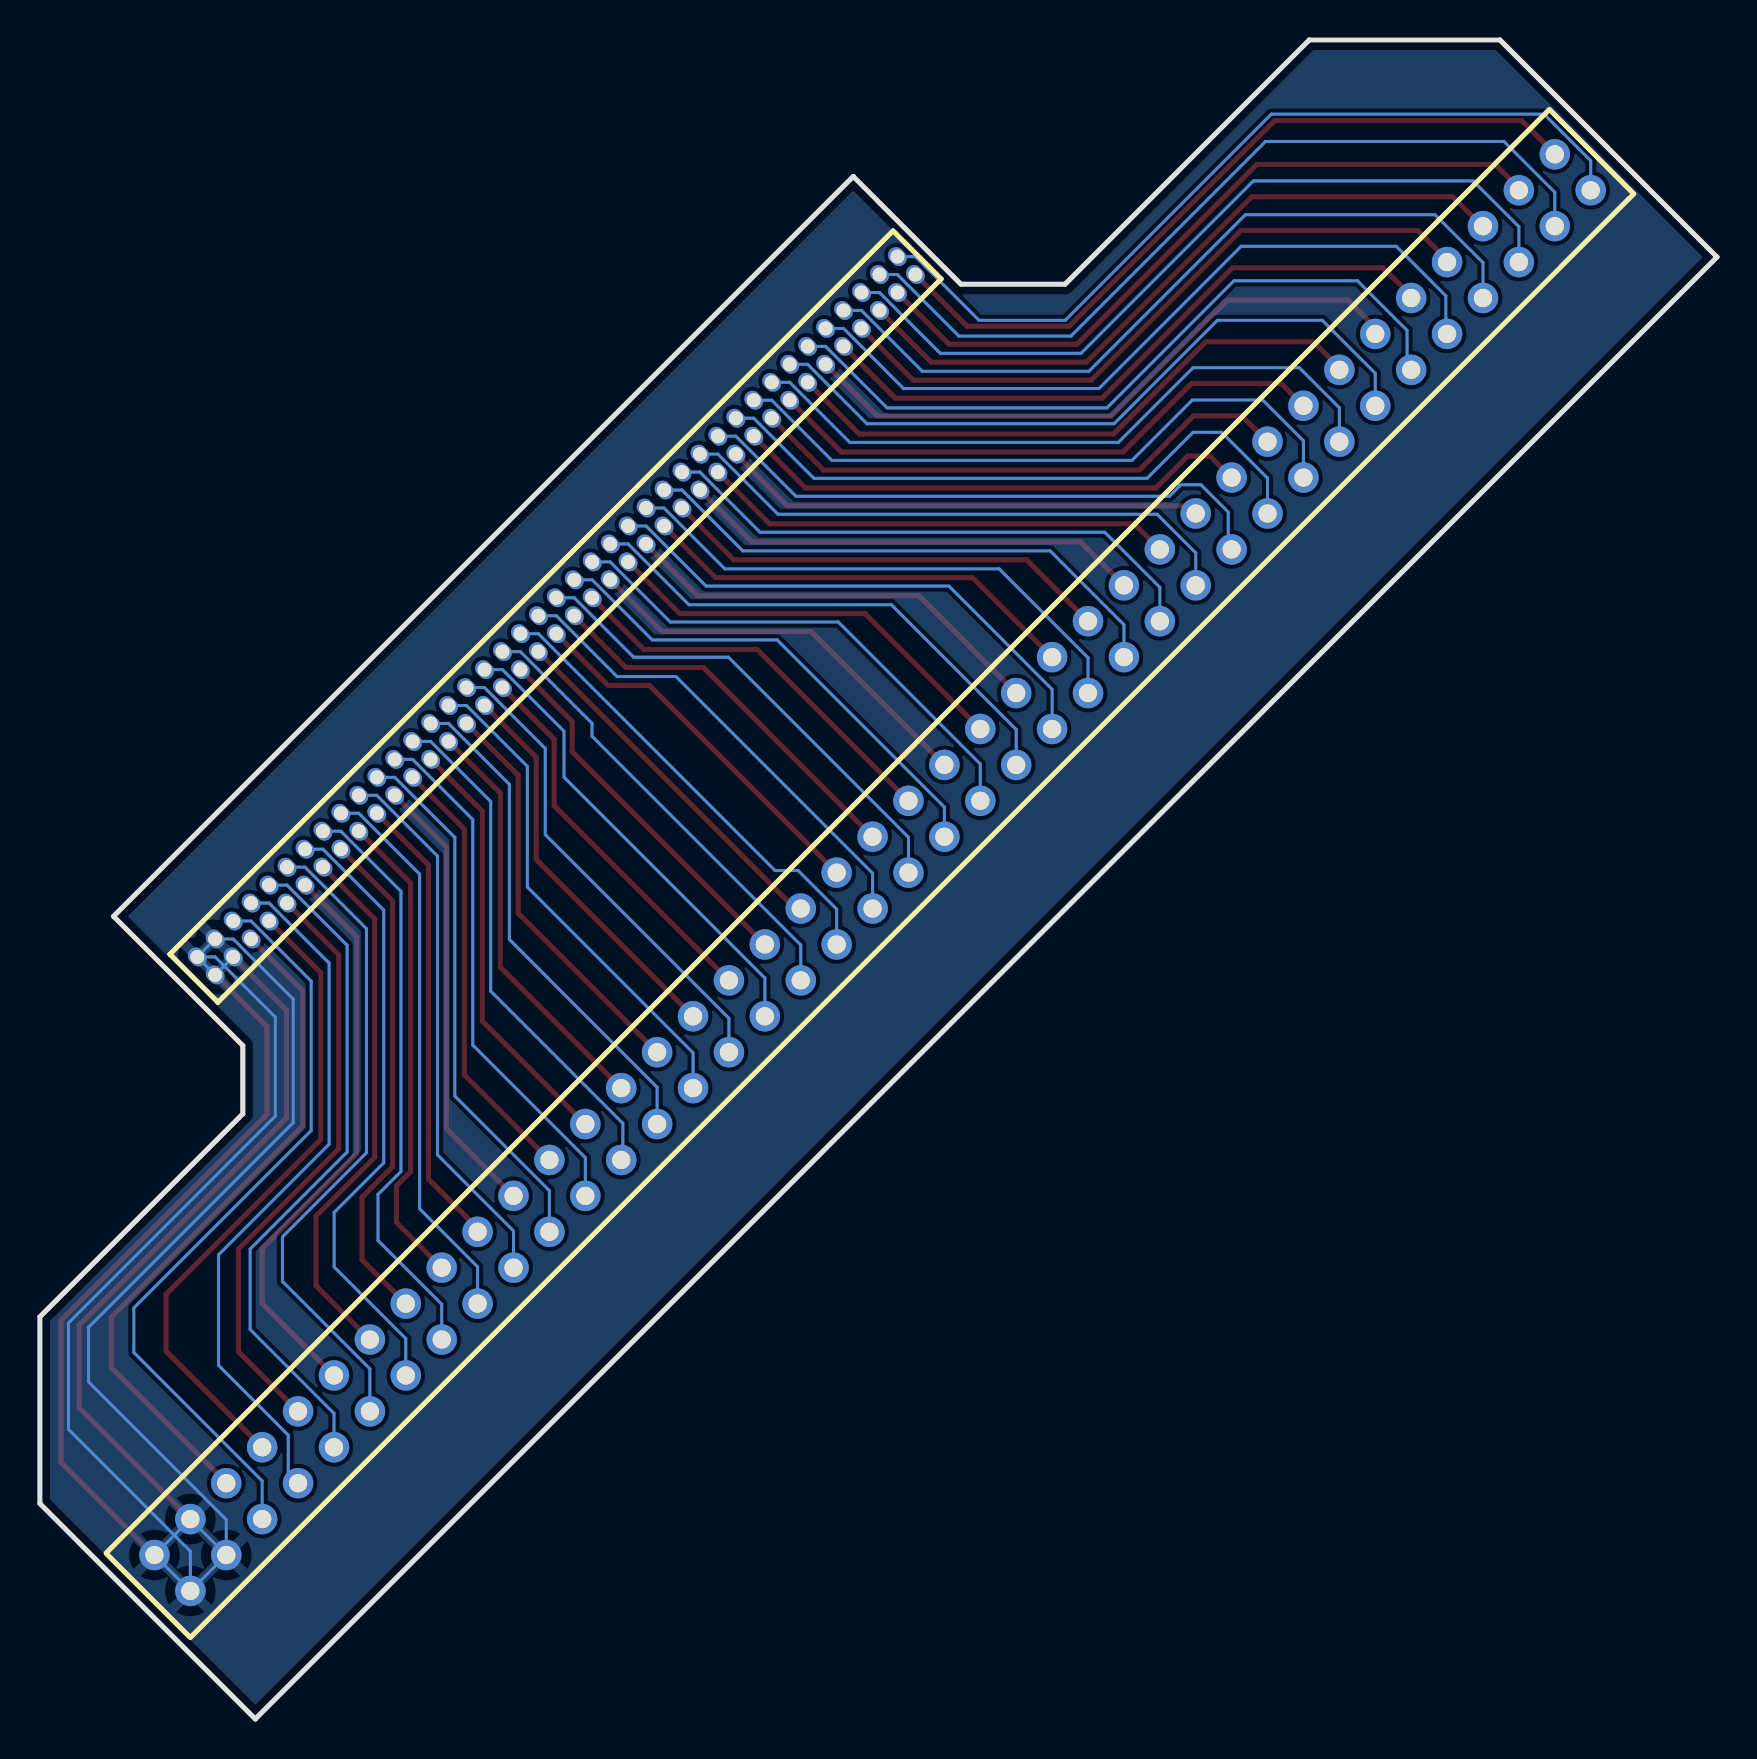
[diagram p5: board, bottom side, seen from below]

Outline 83.89 x 83.97 mm; copper layers: Top Layer, Bottom Layer. Coordinates in mm from the lower left corner of the outline.
Outline path: 0,73.11 10.86,83.97 20.4,83.97 32.61,71.75 37.82,71.75 43.21,77.14 80.21,40.14 73.74,33.68 73.74,30.26 83.89,20.12 83.89,10.78 73.11,0 0,73.11
Stack: Top Layer 0.035mm / Dielectric1 1.51mm FR4 er 4.5 / Bottom Layer 0.035mm

## Design rules (mm)
template: JLCPCB Capability(Two Layers Board)
spacing copperThickness1oz (default): track to track 0.102, other pairs 0.152 to 0.3
spacing copperThickness2oz: track to track 0.203, other pairs 0.152 to 0.3
track width copperThickness1oz (default): min 0.127, default 0.254, max 2.54
track width copperThickness2oz: min 0.203, default 0.254, max 2.54
differential pair differentialPair (default): width min 0.127, default 0.254, max 2.54; gap min 0.152, default 0.152
via viaSize (default): diameter min 0.5, default 0.61, max 10; hole min 0.3, default 0.305, max 6.3

## Placement (name value [footprint] x y rotation side)
U2  -  [XC7A35T_127_PIN81_PIN160]  58.73 54.32 225 top
U4  -  [XC7A35T_254_PIN81_PIN160]  41.34 43.4 225 top

## Footprints (pads in the part's own frame, mm; a bottom-side part is the same pattern mirrored in y, then rotated)
XC7A35T_127_PIN81_PIN160
  oval 1x0.8 hole 0.61x0.7: 81(-0.763,23.692) 82(0.507,23.692) 83(-0.763,22.422) 84(0.507,22.422) 85(-0.763,21.152) 86(0.507,21.151) 87(-0.763,19.881) 88(0.507,19.881) 89(-0.763,18.611) 90(0.507,18.611) 91(-0.763,17.341) 92(0.507,17.341) 93(-0.763,16.072) 94(0.507,16.072) 95(-0.763,14.802) 96(0.507,14.802) 97(-0.763,13.531) 98(0.507,13.531) 99(-0.763,12.261) 100(0.507,12.261) 101(-0.763,10.992) 102(0.507,10.992) 103(-0.763,9.722) 104(0.507,9.722) 105(-0.763,8.451) 106(0.507,8.451) 107(-0.763,7.181) 108(0.507,7.181) 109(-0.763,5.912) 110(0.507,5.912) 111(-0.763,4.642) 112(0.507,4.641) 113(-0.763,3.372) 114(0.507,3.372) 115(-0.763,2.101) 116(0.507,2.102) 117(-0.763,0.832) 118(0.507,0.832) 119(-0.763,-0.439) 120(0.507,-0.439) 121(-0.763,-1.708) 122(0.507,-1.708) 123(-0.763,-2.978) 124(0.507,-2.978) 125(-0.763,-4.248) 126(0.507,-4.248) 127(-0.763,-5.519) 128(0.507,-5.519) 129(-0.763,-6.788) 130(0.507,-6.788) 131(-0.763,-8.059) 132(0.507,-8.059) 133(-0.763,-9.329) 134(0.507,-9.329) 135(-0.763,-10.598) 136(0.507,-10.598) 137(-0.763,-11.868) 138(0.507,-11.868) 139(-0.763,-13.139) 140(0.507,-13.139) 141(-0.763,-14.409) 142(0.507,-14.409) 143(-0.763,-15.678) 144(0.507,-15.678) 145(-0.763,-16.948) 146(0.507,-16.948) 147(-0.763,-18.218) 148(0.507,-18.218) 149(-0.763,-19.488) 150(0.507,-19.488) 151(-0.763,-20.759) 152(0.507,-20.759) 153(-0.763,-22.029) 154(0.507,-22.029) 155(-0.763,-23.299) 156(0.507,-23.299) 157(-0.763,-24.568) 158(0.507,-24.569) 159(-0.763,-25.838) 160(0.507,-25.838)
XC7A35T_254_PIN81_PIN160
  round 1.524 hole 0.914: 81(1.397,50.927) 82(-1.143,50.927) 83(1.397,48.387) 84(-1.143,48.387) 85(1.397,45.847) 86(-1.143,45.847) 87(1.397,43.307) 88(-1.143,43.307) 89(1.397,40.767) 90(-1.143,40.767) 91(1.397,38.227) 92(-1.143,38.227) 93(1.397,35.687) 94(-1.143,35.687) 95(1.397,33.147) 96(-1.143,33.147) 97(1.397,30.607) 98(-1.143,30.607) 99(1.397,28.067) 100(-1.143,28.067) 101(1.397,25.527) 102(-1.143,25.527) 103(1.397,22.987) 104(-1.143,22.987) 105(1.397,20.447) 106(-1.143,20.447) 107(1.397,17.907) 108(-1.143,17.907) 109(1.397,15.367) 110(-1.143,15.367) 111(1.397,12.827) 112(-1.143,12.827) 113(1.397,10.287) 114(-1.143,10.287) 115(1.397,7.747) 116(-1.143,7.747) 117(1.397,5.207) 118(-1.143,5.207) 119(1.397,2.667) 120(-1.143,2.667) 121(1.397,0.127) 122(-1.143,0.127) 123(1.397,-2.413) 124(-1.143,-2.413) 125(1.397,-4.953) 126(-1.143,-4.953) 127(1.397,-7.493) 128(-1.143,-7.493) 129(1.397,-10.033) 130(-1.143,-10.033) 131(1.397,-12.573) 132(-1.143,-12.573) 133(1.397,-15.113) 134(-1.143,-15.113) 135(1.397,-17.653) 136(-1.143,-17.653) 137(1.397,-20.193) 138(-1.143,-20.193) 139(1.397,-22.733) 140(-1.143,-22.733) 141(1.397,-25.273) 142(-1.143,-25.273) 143(1.397,-27.813) 144(-1.143,-27.813) 145(1.397,-30.353) 146(-1.143,-30.353) 147(1.397,-32.893) 148(-1.143,-32.893) 149(1.397,-35.433) 150(-1.143,-35.433) 151(1.397,-37.973) 152(-1.143,-37.973) 153(1.397,-40.513) 154(-1.143,-40.513) 155(1.397,-43.053) 156(-1.143,-43.053) 157(1.397,-45.593) 158(-1.143,-45.593) 159(1.397,-48.133) 160(-1.143,-48.133)

## Nets
As in the schematic.

## Routing (per net, layer and track width the routed paths; a pad name or vN(x,y) marks a point on that pad's centre or on a via; arc(x,y) is an arc through that point)
GND: length 166.8
  Top Layer w0.254: U2.84 71.55,35.44 71.55,30.08 81.93,19.7 81.93,15.56 U4.84 ; U2.82 72.53,34.63 72.53,30.24 82.83,19.95 82.83,12.83 78.2,8.2 U4.82
  Bottom Layer w0.152: U2.84 74.67,37.66 ; 74.67,37.66 75.12,38.11 U2.81 ; 74.67,37.66 72.12,35.1 72.12,30.15 82.46,19.8 82.46,14.49 77.17,9.19 ; 74.67,37.66 U2.82 U2.81 ; U4.81 76.36,8.39 77.17,9.19 ; U4.81 U4.82 77.17,9.19 ; U4.81 U4.83 ; 77.17,9.19 U4.84 U4.83 ; U4.83 74.57,9.97 81.46,16.86 81.46,19.59 71.22,29.82 71.22,36 74.22,39.01 U2.83 U2.81
$1N559: length 42.7
  Bottom Layer w0.152: U4.159 6.32,77.93 8.64,80.26 22.29,80.26 32.6,69.95 36.91,69.95 40.1,73.13 U2.159
$1N560: length 41.8
  Bottom Layer w0.152: U2.157 41,72.24 37.92,69.16 32.32,69.16 22.58,78.89 10.66,78.89 8.11,76.35 U4.157
$1N561: length 40.4
  Bottom Layer w0.152: U2.155 41.9,71.34 38.85,68.29 31.81,68.29 23.19,76.92 12.2,76.92 9.91,74.63 U4.155
$1N562: length 39.2
  Bottom Layer w0.152: U2.153 42.79,70.44 39.75,67.4 31.42,67.4 23.59,75.23 14.1,75.23 11.71,72.83 U4.153
$1N563: length 38.2
  Bottom Layer w0.152: U4.151 13.56,69.33 13.56,71.17 16.04,73.65 23.8,73.65 30.91,66.53 40.69,66.53 43.69,69.54 U2.151
$1N564: length 37
  Bottom Layer w0.152: U2.149 44.59,68.64 41.51,65.56 30.52,65.56 24.16,71.92 17.98,71.92 15.5,69.44 15.5,67.68 U4.149
$1N565: length 35.4
  Bottom Layer w0.152: U2.147 45.49,67.75 42.52,64.77 30.16,64.77 24.99,69.95 19.74,69.95 17.09,67.3 U4.147
$1N566: length 33.7
  Bottom Layer w0.152: U2.145 46.39,66.85 43.38,63.84 29.94,63.84 26.21,67.58 20.89,67.58 18.89,65.57 U4.145
$1N567: length 32.7
  Bottom Layer w0.152: U4.143 20.69,63.92 22.72,65.96 26.24,65.96 29.26,62.94 44.28,62.94 47.28,65.95 48.18,65.95
$1N568: length 31.5
  Bottom Layer w0.152: U2.141 48.18,65.05 45.18,62.04 28.51,62.04 26.21,64.34 24.77,64.34 22.48,62.05 U4.141
$1N569: length 29.6
  Bottom Layer w0.152: 49.98,64.15 49.08,64.15 46.07,61.15 27.39,61.15 26.89,61.65 26.89,61.72 25.81,61.72 24.45,60.36 24.45,58.66 U4.139
$1N570: length 28.5
  Bottom Layer w0.152: U4.137 26.07,58.32 28,60.25 46.97,60.25 49.98,63.25 U2.137
$1N571: length 28
  Bottom Layer w0.152: 51.77,62.36 50.88,62.36 47.87,59.35 30.63,59.35 27.87,56.59 U4.135
$1N572: length 27.4
  Bottom Layer w0.152: U4.133 29.67,54.73 33.36,58.42 48.73,58.42 51.77,61.46 U2.133
$1N573: length 27
  Bottom Layer w0.152: U4.131 31.46,53.07 35.91,57.52 49.63,57.52 52.67,60.56 53.57,60.56
$1N574: length 26.6
  Bottom Layer w0.152: U4.129 33.26,51.49 38.42,56.66 50.56,56.66 53.57,59.66 U2.129
$1N575: length 25.9
  Bottom Layer w0.152: U4.127 35.06,49.48 41.3,55.72 51.43,55.72 54.47,58.76 55.36,58.76
$1N576: length 25.4
  Bottom Layer w0.152: U4.125 36.85,47.76 43.95,54.86 52.36,54.86 55.37,57.87 U2.125
$1N577: length 24.7
  Bottom Layer w0.152: U4.123 38.65,45.6 47.01,53.96 53.26,53.96 56.26,56.97 57.16,56.97
$1N578: length 24.3
  Bottom Layer w0.152: U2.121 57.16,56.07 54.19,53.1 49.45,53.1 40.44,44.09 U4.121
$1N579: length 23.8
  Bottom Layer w0.152: 58.96,55.17 58.06,55.17 55.02,52.13 52.07,52.13 42.24,42.3 U4.119
$1N580: length 23.3
  Bottom Layer w0.152: U2.117 58.96,54.27 47.12,42.43 45.97,42.43 44.03,40.5 U4.117
$1N581: length 23.1
  Bottom Layer w0.152: 60.75,53.38 59.86,53.38 56.27,49.8 56.27,49.15 45.83,38.71 U4.115
$1N582: length 23.7
  Bottom Layer w0.152: U4.113 47.63,37.05 57.68,47.1 57.68,49.4 60.75,52.48 U2.113
$1N583: length 24.2
  Bottom Layer w0.152: U2.111 61.65,51.58 58.61,48.54 58.61,44.23 49.42,35.04 U4.111
$1N584: length 24.7
  Bottom Layer w0.152: 63.45,50.68 62.55,50.68 59.51,47.64 59.51,41.61 51.22,33.32 51.22,31.55
$1N585: length 25.2
  Bottom Layer w0.152: 53.02,29.75 53.02,31.59 60.41,38.98 60.41,46.74 63.45,49.78 U2.107
$1N586: length 25.8
  Bottom Layer w0.152: U2.105 64.35,48.89 61.34,45.88 61.34,36.4 54.73,29.79 54.73,28.04 54.81,27.96
$1N587: length 26.3
  Bottom Layer w0.152: U2.103 65.24,47.99 62.24,44.98 62.24,33.7 56.61,28.07 56.61,26.16
$1N588: length 26.8
  Bottom Layer w0.152: U2.101 66.14,47.09 63.14,44.08 63.14,31.15 58.4,26.42 58.4,24.36
$1N589: length 27.4
  Bottom Layer w0.152: U2.99 67.04,46.19 64,43.15 64,28.21 60.2,24.41 60.2,22.57
$1N590: length 27.9
  Bottom Layer w0.152: U2.97 67.94,45.29 64.9,42.25 64.9,25.51 62,22.61 62,20.77
$1N591: length 29.4
  Bottom Layer w0.152: U2.95 68.84,44.4 65.83,41.39 65.83,27.38 66.98,26.23 66.98,23.93 63.79,20.75 63.79,18.98
$1N592: length 31
  Bottom Layer w0.152: 65.59,17.18 65.59,19.02 69.17,22.6 69.17,25.33 66.69,27.81 66.69,40.46 69.73,43.5 U2.93
$1N593: length 32.9
  Bottom Layer w0.152: U2.91 70.63,42.6 67.55,39.52 67.55,28.31 71.76,24.11 71.76,21.89 67.38,17.51 67.38,15.38
$1N594: length 34
  Bottom Layer w0.152: 69.18,13.59 69.18,15.28 73.37,19.48 73.37,23.5 68.52,28.35 68.52,38.7 71.53,41.7 U2.89
$1N595: length 35.1
  Bottom Layer w0.152: U4.87 71.47,12.29 71.47,14.2 74.95,17.68 74.95,23.21 69.42,28.75 69.42,37.8 72.43,40.8 U2.87
$1N596: length 38.4
  Bottom Layer w0.152: U2.85 73.33,39.91 70.32,36.9 70.32,29.43 79.19,20.56 79.19,18.33 72.77,11.91 U4.85
$1N597: length 34.6
  Top Layer w0.254: U4.86 74.57,11.83 80.32,17.58 80.32,20.09 70.74,29.67 70.74,36.42 U2.86
$1N598: length 32.6
  Top Layer w0.254: U2.88 69.84,37.32 69.84,28.99 77.59,21.24 77.59,18.4 72.77,13.59
$1N599: length 29.8
  Top Layer w0.254: U2.90 68.94,38.22 68.94,28.52 73.96,23.5 73.96,18.37 70.98,15.38
$1N600: length 29
  Top Layer w0.254: U2.92 68.04,39.12 68.04,28.27 72.77,23.54 72.77,20.77 69.18,17.18
$1N601: length 27
  Top Layer w0.254: 67.38,18.98 70.08,21.67 70.08,25.16 67.15,28.09 67.15,40.01 U2.94
$1N602: length 25.3
  Top Layer w0.254: 65.59,20.77 67.78,22.96 67.78,26.09 66.25,27.62 66.25,40.91 U2.96
$1N603: length 24.1
  Top Layer w0.254: U2.98 65.35,41.81 65.35,27.37 66.05,26.66 66.05,24.83 63.79,22.57
$1N604: length 23
  Top Layer w0.254: U2.100 64.45,42.71 64.45,27 62,24.54 62,24.36
$1N605: length 22.5
  Top Layer w0.254: U2.102 63.55,43.61 63.55,29.51 60.2,26.16
$1N606: length 22
  Top Layer w0.254: U2.104 62.66,44.5 62.66,32.21 58.4,27.96
$1N607: length 21.4
  Top Layer w0.254: 56.61,29.75 61.76,34.9 61.76,45.4 U2.106
$1N608: length 20.9
  Top Layer w0.254: U2.108 60.86,46.3 60.86,37.6 54.81,31.55
$1N609: length 20.4
  Top Layer w0.254: 53.02,33.35 59.96,40.29 59.96,47.2 U2.110
$1N610: length 19.9
  Top Layer w0.254: 61.65,50.68 59.06,48.1 59.06,42.99 51.22,35.14
$1N611: length 19.3
  Top Layer w0.254: U4.114 58.17,45.68 58.17,48.99 U2.114
$1N612: length 18.8
  Top Layer w0.254: U2.116 57.27,49.89 57.27,48.37 U4.116
$1N613: length 18.4
  Top Layer w0.254: 58.96,53.38 46.11,40.53 U4.118
$1N614: length 19
  Top Layer w0.254: U2.120 55.47,51.69 53.4,51.69 U4.120
$1N615: length 19.5
  Top Layer w0.254: U4.122 50.7,52.59 54.57,52.59 57.16,55.17
$1N616: length 20
  Top Layer w0.254: U2.124 53.68,53.48 48.01,53.48 U4.124
$1N617: length 20.6
  Top Layer w0.254: U4.126 45.31,54.38 52.78,54.38 55.36,56.97
$1N618: length 21.1
  Top Layer w0.254: U2.128 51.88,55.28 42.62,55.28 U4.128
$1N619: length 21.6
  Top Layer w0.254: U4.130 39.93,56.18 50.98,56.18 53.57,58.76
$1N620: length 22.1
  Top Layer w0.254: U2.132 50.08,57.08 37.23,57.08 U4.132
$1N621: length 22.7
  Top Layer w0.254: U4.134 34.54,57.97 49.19,57.97 51.77,60.56
$1N622: length 23.2
  Top Layer w0.254: U2.136 48.29,58.87 31.84,58.87 U4.136
$1N623: length 23.7
  Top Layer w0.254: U4.138 29.15,59.77 47.39,59.77 49.98,62.36
$1N624: length 24.2
  Top Layer w0.254: U2.140 46.49,60.67 26.46,60.67 U4.140
$1N625: length 26.1
  Top Layer w0.254: 48.18,64.15 45.59,61.57 28.06,61.57 26.47,63.16 25.36,63.16 U4.142
$1N626: length 27.5
  Top Layer w0.254: U4.144 23.78,65.17 26.18,65.17 28.89,62.46 44.69,62.46 U2.144
$1N627: length 28.6
  Top Layer w0.254: U4.146 21.8,66.79 26.29,66.79 29.72,63.36 43.8,63.36 46.38,65.95
$1N628: length 30.2
  Top Layer w0.254: U2.148 42.9,64.26 30.18,64.26 25.57,68.87 20.18,68.87 18.89,67.58 U4.148
$1N629: length 31.9
  Top Layer w0.254: U2.150 42,65.16 30.29,65.16 24.49,70.95 18.46,70.95 17.09,69.59 U4.150
$1N630: length 32.9
  Top Layer w0.254: U2.152 41.1,66.06 30.76,66.06 24.24,72.57 16.7,72.57 15.3,71.17 U4.152
$1N631: length 34.2
  Top Layer w0.254: U2.154 40.21,66.95 31.3,66.95 23.81,74.44 14.98,74.44 13.5,72.97 U4.154
$1N632: length 35.3
  Top Layer w0.254: U4.156 11.74,74.65 13.22,76.13 23.27,76.13 31.55,67.85 39.31,67.85 U2.156
$1N633: length 36.5
  Top Layer w0.254: U4.158 9.91,76.56 11.1,77.74 23.02,77.74 32.02,68.75 38.41,68.75 U2.158
$1N634: length 38
  Top Layer w0.254: U2.160 37.51,69.65 32.41,69.65 22.12,79.93 9.77,79.93 8.11,78.28 U4.160

## Copper pours and planes (outline as drawn; the poured copper is in the pictures)
GND on Top Layer: 80.21,40.14 73.74,33.68 73.74,30.26 83.89,20.12 83.89,10.78 73.11,0 0,73.11 10.86,83.97 20.4,83.97 32.61,71.75 37.82,71.75 43.21,77.14
GND on Bottom Layer: 80.21,40.14 73.74,33.68 73.74,30.26 83.89,20.12 83.89,10.78 73.11,0 0,73.11 10.86,83.97 20.4,83.97 32.61,71.75 37.82,71.75 43.21,77.14
